# EAGLE design Retro-Lite-Dock-PCB_Pico_Version (EAGLE 9.6.1)

## Sheet 1 of 5: USB-Hub
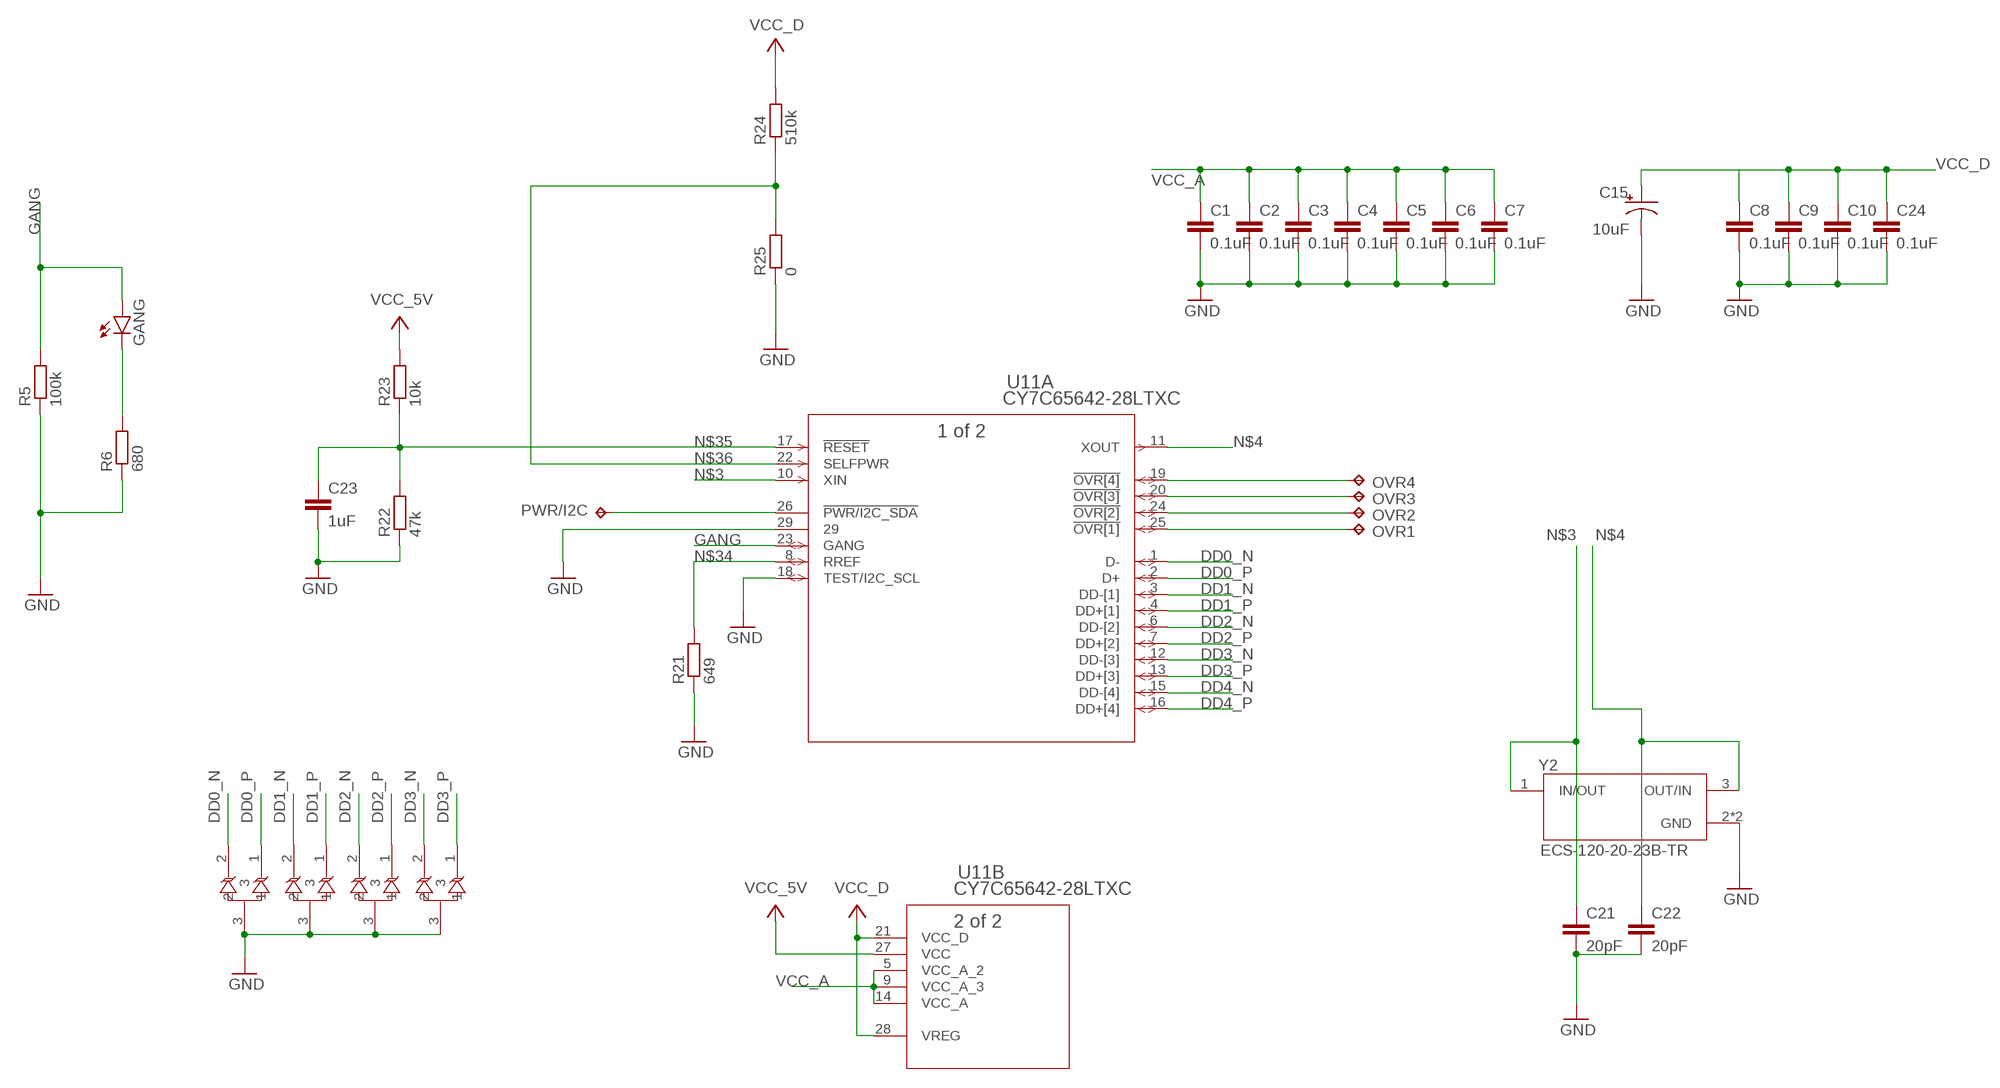
[diagram p0: schematic, sheet 1]

### Parts
C1  0.1uF  C-EUC0603  [C0603]
C2  0.1uF  C-EUC0603  [C0603]
C3  0.1uF  C-EUC0603  [C0603]
C4  0.1uF  C-EUC0603  [C0603]
C5  0.1uF  C-EUC0603  [C0603]
C6  0.1uF  C-EUC0603  [C0603]
C7  0.1uF  C-EUC0603  [C0603]
C8  0.1uF  C-EUC0603  [C0603]
C9  0.1uF  C-EUC0603  [C0603]
C10  0.1uF  C-EUC0603  [C0603]
C15  10uF  PANASONIC-POLAR-SMD  [CAPAE660X610]
C21  20pF  C-EUC0603  [C0603]
C22  20pF  C-EUC0603  [C0603]
C23  1uF  C-EUC0603  [C0603]
C24  0.1uF  C-EUC0603  [C0603]
GANG  LEDSML0603  [SML0603]
OVR1  TPTP09R  [TP09R]
OVR2  TPTP09R  [TP09R]
OVR3  TPTP09R  [TP09R]
OVR4  TPTP09R  [TP09R]
PWR/I2C  TPTP09R  [TP09R]
R5  100k  R-EU_R0603  [R0603]
R6  680  R-EU_R0603  [R0603]
R21  649  R-EU_R0603  [R0603]
R22  47k  R-EU_R0603  [R0603]
R23  10k  R-EU_R0603  [R0603]
R24  510k  R-EU_R0603  [R0603]
R25  0  R-EU_R0603  [R0603]
U2  RCLAMP0582BQTCT  [SC75-3L_SEM]
U3  RCLAMP0582BQTCT  [SC75-3L_SEM]
U4  RCLAMP0582BQTCT  [SC75-3L_SEM]
U10  RCLAMP0582BQTCT  [SC75-3L_SEM]
U11  CY7C65642-28LTXC  [QFN-28]
Y2  ECS-120-20-23B-TR  [XTAL_ECS-120-20-23B-TR]

### Nets
DD0_N [USB2.0]: U10.2 U11.1(A:D-) ; also sheet 4
DD0_P [USB2.0]: U10.1 U11.2(A:D+) ; also sheet 4
DD1_N [USB2.0]: U2.2 U11.3(A:DD-[1]) ; also sheet 5
DD1_P [USB2.0]: U2.1 U11.4(A:DD+[1]) ; also sheet 5
DD2_N [USB2.0]: U3.2 U11.6(A:DD-[2]) ; also sheet 5
DD2_P [USB2.0]: U3.1 U11.7(A:DD+[2]) ; also sheet 5
DD3_N [USB2.0]: U4.2 U11.12(A:DD-[3]) ; also sheet 5
DD3_P [USB2.0]: U4.1 U11.13(A:DD+[3]) ; also sheet 5
DD4_N [USB2.0]: U11.15(A:DD-[4]) ; also sheet 3
DD4_P [USB2.0]: U11.16(A:DD+[4]) ; also sheet 3
GANG: GANG.A R5.2 U11.23(A:GANG)
GND: C1.2 C2.2 C3.2 C4.2 C5.2 C6.2 C7.2 C8.2 C9.2 C10.2 C15.2(-) C21.2 C22.2 C23.2 C24.2 R5.1 R6.1 R21.1 R22.1 R25.1 U2.3 U3.3 U4.3 U10.3 U11.18(A:TEST/I2C_SCL) U11.29 Y2.2(GND) Y2.4(GND) ; also sheet 2,3,4,5
N$1: GANG.C R6.2
N$3: C21.1 U11.10(A:XIN) Y2.1(IN/OUT)
N$4: C22.1 U11.11(A:XOUT) Y2.3(OUT/IN)
N$19: OVR1.TP U11.25(A:!OVR[1])
N$20: OVR2.TP U11.24(A:!OVR[2])
N$21: OVR3.TP U11.20(A:!OVR[3])
N$22: OVR4.TP U11.19(A:!OVR[4])
N$34: R21.2 U11.8(A:RREF)
N$35: C23.1 R22.2 R23.1 U11.17(A:!RESET)
N$36: R24.1 R25.2 U11.22(A:SELFPWR)
PWR/I2C_SDA: PWR/I2C.TP U11.26(A:!PWR/I2C_SDA)
VCC_5V: R23.2 U11.27(B:VCC) ; supply symbol labelled VCC ; also sheet 2,3,4,5
VCC_A: C1.1 C2.1 C3.1 C4.1 C5.1 C6.1 C7.1 U11.5(B:VCC_A_2) U11.9(B:VCC_A_3) U11.14(B:VCC_A) ; also sheet 4
VCC_D: C8.1 C9.1 C10.1 C15.1(+) C24.1 R24.2 U11.21(B:VCC_D) U11.28(B:VREG) ; supply symbol labelled VCC ; also sheet 4

### Notes on the sheet
- 10uF

## Sheet 2 of 5: MAXM17634
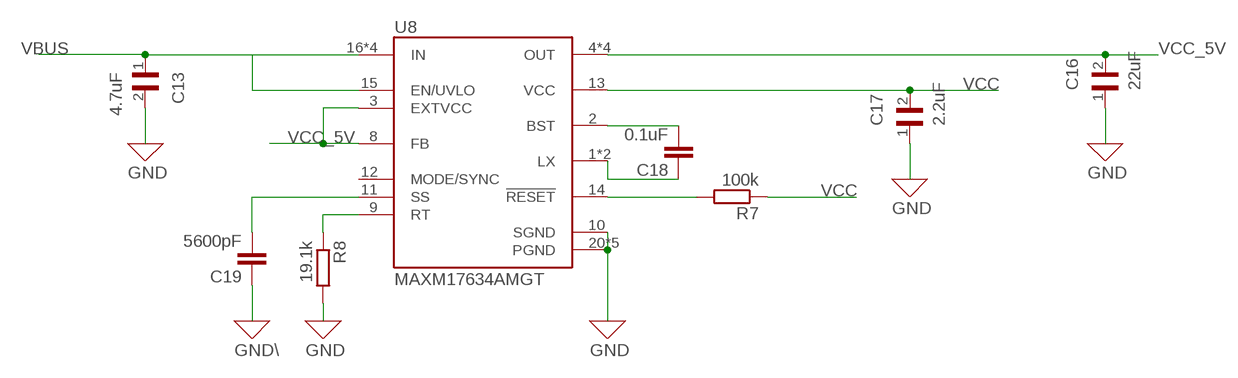
[diagram p1: schematic, sheet 2]

### Parts
C13  4.7uF  GRM31CR71H475KA12K  [CAPC3216X180N]
C16  22uF  GRM32ER71E226KE15K  [CAPC3225X270N]
C17  2.2uF  GRM188R70J225KE15J  [CAPC1608X90N]
C18  0.1uF  C-EUC0603  [C0603]
C19  5600pF  C-EUC0603  [C0603]
R7  100k  R-EU_R0603  [R0603]
R8  19.1k  R-EU_R0603  [R0603]
U8  MAXM17634AMGT  [QFN50P400X400X180-25N]

### Nets
GND: C13.2 C16.1 C17.1 R8.2 U8.10(SGND) U8.20(PGND) U8.21(PGND) U8.22(PGND) U8.23(PGND) U8.25(PGND) ; also sheet 1,3,4,5
GND\: C19.1 ; supply symbol labelled GND
N$8: R7.2 U8.14(!RESET!)
N$11: C18.2 U8.2(BST)
N$12: C18.1 U8.1(LX) U8.24(LX)
N$13: C19.2 U8.11(SS)
N$14: R8.1 U8.9(RT)
VBUS: C13.1 U8.15(EN/UVLO) U8.16(IN) U8.17(IN) U8.18(IN) U8.19(IN) ; also sheet 4
VCC: C17.2 R7.1 U8.13(VCC)
VCC_5V: C16.2 U8.3(EXTVCC) U8.4(OUT) U8.5(OUT) U8.6(OUT) U8.7(OUT) U8.8(FB) ; also sheet 1,3,4,5
Unconnected: U8.12(MODE/SYNC)

## Sheet 3 of 5: RP2040
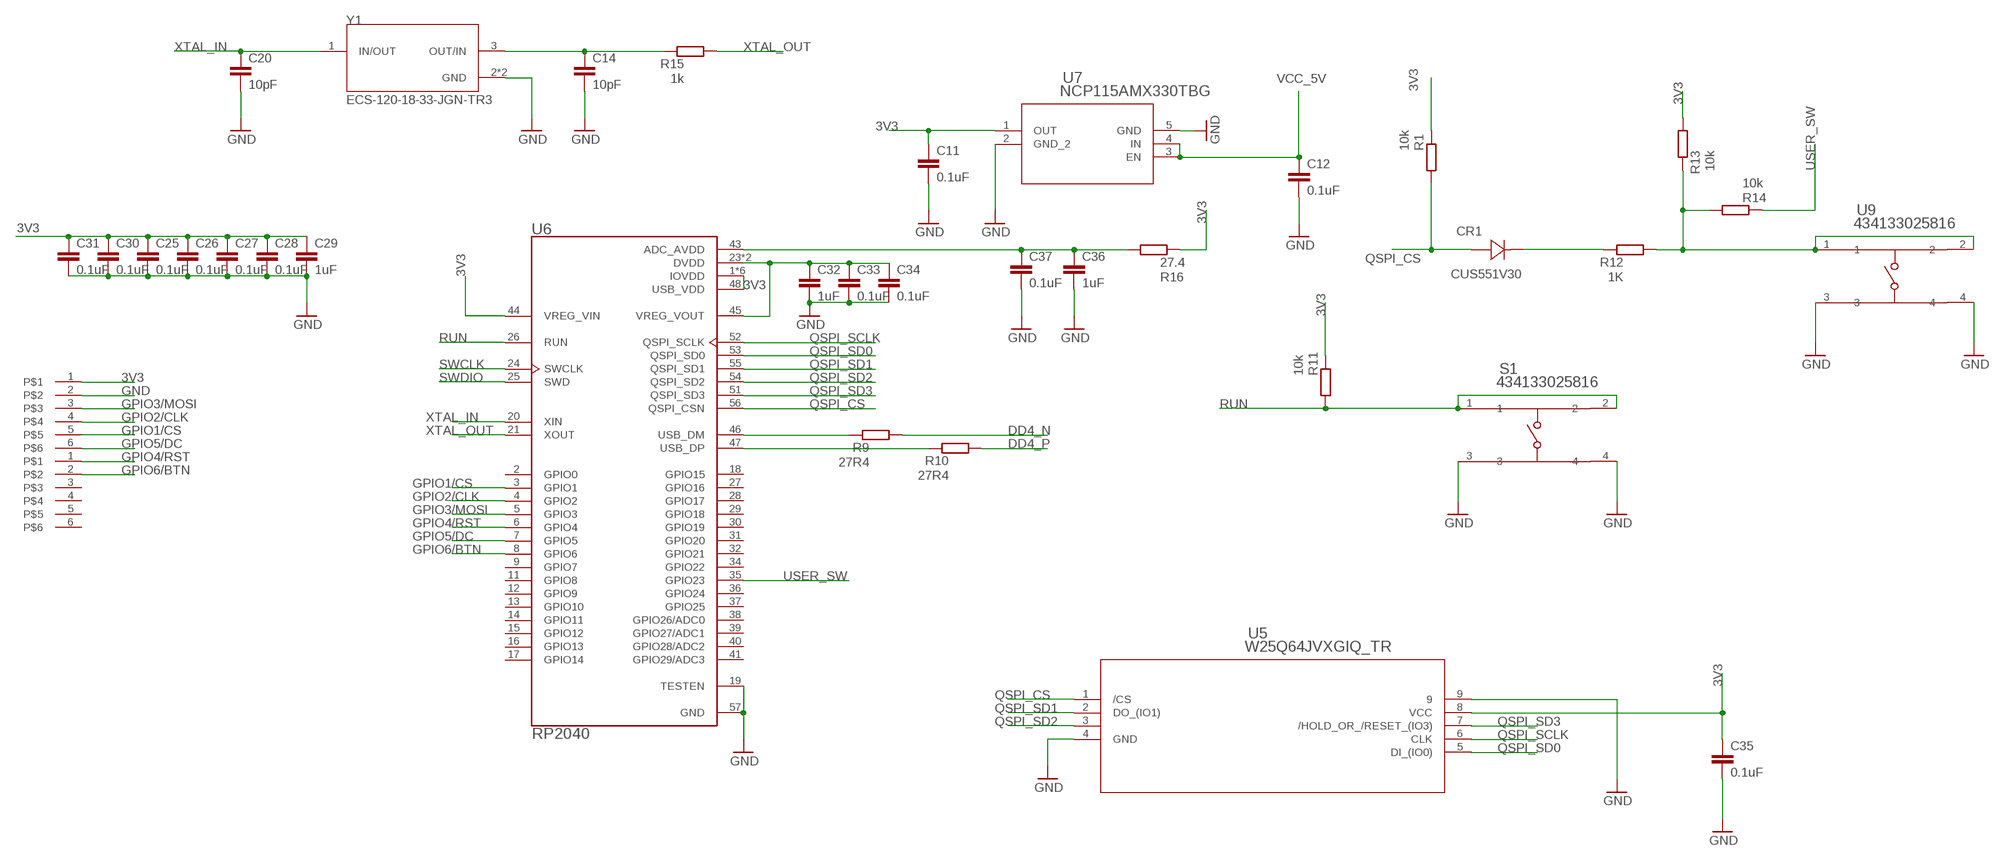
[diagram p2: schematic, sheet 3]

### Parts
C11  0.1uF  C-EUC0603  [C0603]
C12  0.1uF  C-EUC0603  [C0603]
C14  10pF  C-EUC0603  [C0603]
C20  10pF  C-EUC0603  [C0603]
C25  0.1uF  C-EUC0603  [C0603]
C26  0.1uF  C-EUC0603  [C0603]
C27  0.1uF  C-EUC0603  [C0603]
C28  0.1uF  C-EUC0603  [C0603]
C29  1uF  C-EUC0402  [C0402]
C30  0.1uF  C-EUC0402  [C0402]
C31  0.1uF  C-EUC0603  [C0603]
C32  1uF  C-EUC0603  [C0603]
C33  0.1uF  C-EUC0402  [C0402]
C34  0.1uF  C-EUC0603  [C0603]
C35  0.1uF  C-EUC0603  [C0603]
C36  1uF  C-EUC0402  [C0402]
C37  0.1uF  C-EUC0402  [C0402]
CR1  CUS551V30  [USC_TOS]
R1  10k  R-EU_R0603  [R0603]
R9  27R4  R-EU_R0402  [R0402]
R10  27R4  R-EU_R0402  [R0402]
R11  10k  R-EU_R0603  [R0603]
R12  1K  R-EU_R0603  [R0603]
R13  10k  R-EU_R0603  [R0603]
R14  10k  R-EU_R0603  [R0603]
R15  1k  R-EU_R0402  [R0402]
R16  27.4  R-EU_R0402  [R0402]
S1  434133025816  [SMD_025816_WRE]
U5  W25Q64JVXGIQ_TR  [DFN_XGIQ_TR_WIN]
U6  RP2040  [QFN40P700X700X90-57N]
U7  NCP115AMX330TBG  [XDFN4_711AJ_ONS]
U9  434133025816  [SMD_025816_WRE]
U$2  6PINEADER  [1MM_PIC-PROGRAMING_HEADER]
U$3  6PINEADER  [1MM_PIC-PROGRAMING_HEADER]
Y1  ECS-120-18-33-JGN-TR3  [XTAL_ECS-120-18-33-JGN-TR3]

### Nets
3V3: C11.1 C25.1 C26.1 C27.1 C28.1 C29.1 C30.1 C31.1 C35.1 R1.2 R11.2 R13.1 R16.2 U5.8(VCC) U6.1(IOVDD) U6.10(IOVDD) U6.22(IOVDD) U6.33(IOVDD) U6.42(IOVDD) U6.44(VREG_VIN) U6.48(USB_VDD) U6.49(IOVDD) U7.1(OUT) U$3.1
DD4_N [USB2.0]: R9.1 ; also sheet 1
DD4_P [USB2.0]: R10.1 ; also sheet 1
GND: C11.2 C12.2 C14.2 C20.2 C25.2 C26.2 C27.2 C28.2 C29.2 C30.2 C31.2 C32.2 C33.2 C34.2 C35.2 C36.2 C37.2 S1.3 S1.4 U5.4(GND) U5.9 U6.19(TESTEN) U6.57(GND) U7.2(GND_2) U7.5(GND) U9.3 U9.4 U$3.2 Y1.2(GND) Y1.4(GND) ; also sheet 1,2,4,5
GPIO1/CS: U6.3(GPIO1) U$3.5
GPIO2/CLK: U6.4(GPIO2) U$3.4
GPIO3/MOSI: U6.5(GPIO3) U$3.3
GPIO4/RST: U6.6(GPIO4) U$2.1
GPIO5/DC: U6.7(GPIO5) U$3.6
GPIO6/BTN: U6.8(GPIO6) U$2.2
N$5: C32.1 C33.1 C34.1 U6.23(DVDD) U6.45(VREG_VOUT) U6.50(DVDD)
N$5_N: R9.2 U6.46(USB_DM)
N$5_P: R10.2 U6.47(USB_DP)
N$15: R12.1 R13.2 R14.1 U9.1 U9.2
N$16: C14.1 R15.2 Y1.3(OUT/IN)
N$17: C36.1 C37.1 R16.1 U6.43(ADC_AVDD)
N$18: CR1.1(CATHODE) R12.2
QSPI_CS: CR1.2(ANODE) R1.1 U5.1(/CS) U6.56(QSPI_CSN)
QSPI_SCLK: U5.6(CLK) U6.52(QSPI_SCLK)
QSPI_SD0: U5.5(DI_(IO0)) U6.53(QSPI_SD0)
QSPI_SD1: U5.2(DO_(IO1)) U6.55(QSPI_SD1)
QSPI_SD2: U5.3(/WP_(IO2)) U6.54(QSPI_SD2)
QSPI_SD3: U5.7(/HOLD_OR_/RESET_(IO3)) U6.51(QSPI_SD3)
RUN: R11.1 S1.1 S1.2 U6.26(RUN)
SWCLK: U6.24(SWCLK) ; also sheet 4
SWDIO: U6.25(SWD) ; also sheet 4
USER_SW: R14.2 U6.35(GPIO23)
VCC_5V: C12.1 U7.3(EN) U7.4(IN) ; also sheet 1,2,4,5
XTAL_IN: C20.1 U6.20(XIN) Y1.1(IN/OUT)
XTAL_OUT: R15.1 U6.21(XOUT)
Unconnected: U6.2(GPIO0) U6.9(GPIO7) U6.11(GPIO8) U6.12(GPIO9) U6.13(GPIO10) U6.14(GPIO11) U6.15(GPIO12) U6.16(GPIO13) U6.17(GPIO14) U6.18(GPIO15) U6.27(GPIO16) U6.28(GPIO17) U6.29(GPIO18) U6.30(GPIO19) U6.31(GPIO20) U6.32(GPIO21) U6.34(GPIO22) U6.36(GPIO24) U6.37(GPIO25) U6.38(GPIO26/ADC0) U6.39(GPIO27/ADC1) U6.40(GPIO28/ADC2) U6.41(GPIO29/ADC3) U$2.3 U$2.4 U$2.5 U$2.6

## Sheet 4 of 5: FFC Connectors
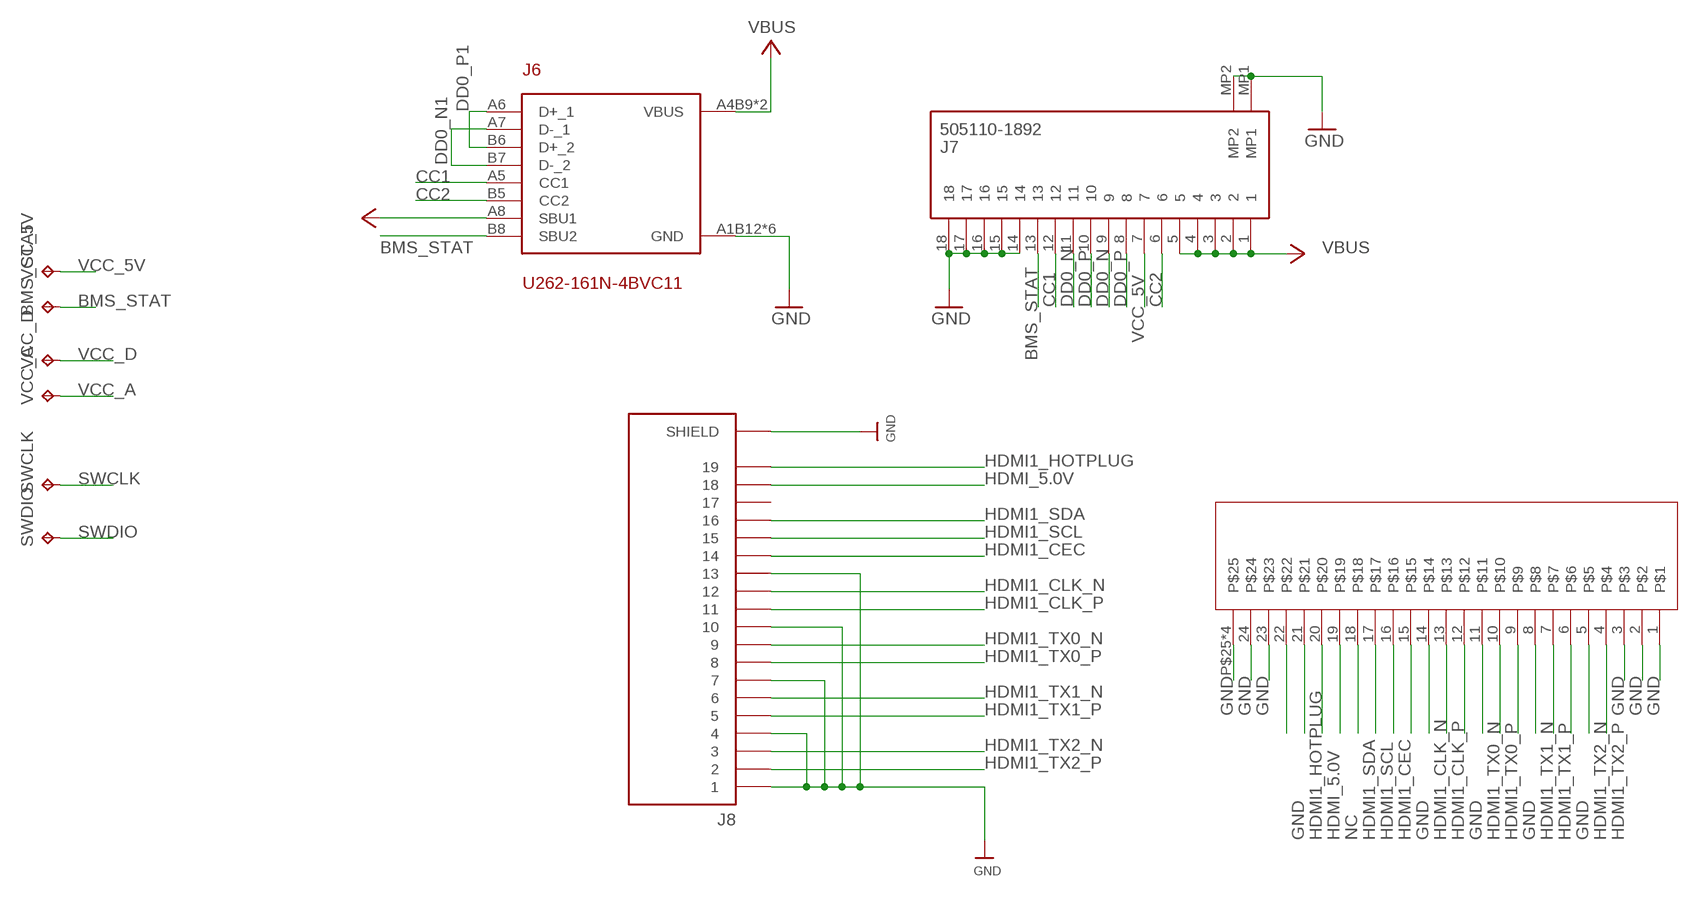
[diagram p3: schematic, sheet 4]

### Parts
BMS_STAT  TPTP09R  [TP09R]
J6  U262-161N-4BVC11  [U262-161N-4BVC11]
J7  505110-1892  [5051101892]
J8  685119136923  [WURTH_685119136923]
SWCLK  TPTP09R  [TP09R]
SWDIO  TPTP09R  [TP09R]
U$1  5022442430_FFC  [5022442430]
VCC_5V  TPTP09R  [TP09R]
VCC_A  TPTP09R  [TP09R]
VCC_D  TPTP09R  [TP09R]

### Nets
BMS_STAT: BMS_STAT.TP J6.B8(SBU2) J7.13
CC1: J6.A5(CC1) J7.12
CC2: J6.B5(CC2) J7.6
DD0_N [USB2.0]: J7.9 J7.11 ; also sheet 1
DD0_N1 [USB2.0]: J6.A7(D-_1) J6.B7(D-_2)
DD0_P [USB2.0]: J7.8 J7.10 ; also sheet 1
DD0_P1 [USB2.0]: J6.A6(D+_1) J6.B6(D+_2)
GND: J6.A1B12(GND) J6.B1A12(GND) J6.SHIELD_1(GND) J6.SHIELD_2(GND) J6.SHIELD_3(GND) J6.SHIELD_4(GND) J7.14 J7.15 J7.16 J7.17 J7.18 J7.MP1 J7.MP2 J8.1 J8.4 J8.7 J8.10 J8.13 J8.S1(SHIELD) J8.S2(SHIELD) J8.S3(SHIELD) J8.S4(SHIELD) U$1.1 U$1.2 U$1.3 U$1.6 U$1.9 U$1.12 U$1.15 U$1.22 U$1.23 U$1.24 U$1.P$25 U$1.P$26 U$1.P$27 U$1.P$28 ; also sheet 1,2,3,5
HDMI1_CEC: J8.14 U$1.16
HDMI1_CLK_N [HDMI]: J8.12 U$1.14
HDMI1_CLK_P [HDMI]: J8.11 U$1.13
HDMI1_HOTPLUG: J8.19 U$1.21
HDMI1_SCL: J8.15 U$1.17
HDMI1_SDA: J8.16 U$1.18
HDMI1_TX0_N [HDMI]: J8.9 U$1.11
HDMI1_TX0_P [HDMI]: J8.8 U$1.10
HDMI1_TX1_N [HDMI]: J8.6 U$1.8
HDMI1_TX1_P [HDMI]: J8.5 U$1.7
HDMI1_TX2_N [HDMI]: J8.3 U$1.5
HDMI1_TX2_P [HDMI]: J8.2 U$1.4
HDMI_5.0V: J8.18 U$1.20
NC: U$1.19
SWCLK: SWCLK.TP ; also sheet 3
SWDIO: SWDIO.TP ; also sheet 3
VBUS: J6.A4B9(VBUS) J6.B4A9(VBUS) J7.1 J7.2 J7.3 J7.4 J7.5 ; supply symbol labelled VCC ; also sheet 2
VCC_5V: J6.A8(SBU1) J7.7 VCC_5V.TP ; supply symbol labelled VCC ; also sheet 1,2,3,5
VCC_A: VCC_A.TP ; also sheet 1
VCC_D: VCC_D.TP ; also sheet 1
Unconnected: J8.17

## Sheet 5 of 5: USB-A Ports
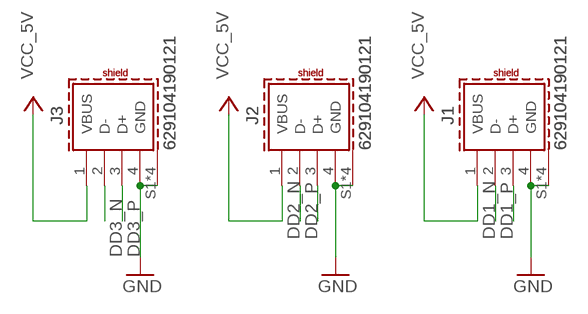
[diagram p4: schematic, sheet 5]

### Parts
J1  629104190121  [629104190121]
J2  629104190121  [629104190121]
J3  629104190121  [629104190121]

### Nets
DD1_N [USB2.0]: J1.2(D-) ; also sheet 1
DD1_P [USB2.0]: J1.3(D+) ; also sheet 1
DD2_N [USB2.0]: J2.2(D-) ; also sheet 1
DD2_P [USB2.0]: J2.3(D+) ; also sheet 1
DD3_N [USB2.0]: J3.2(D-) ; also sheet 1
DD3_P [USB2.0]: J3.3(D+) ; also sheet 1
GND: J1.4(GND) J1.S1(SHIELD) J1.S2(SHIELD) J1.S3(SHIELD) J1.S4(SHIELD) J2.4(GND) J2.S1(SHIELD) J2.S2(SHIELD) J2.S3(SHIELD) J2.S4(SHIELD) J3.4(GND) J3.S1(SHIELD) J3.S2(SHIELD) J3.S3(SHIELD) J3.S4(SHIELD) ; also sheet 1,2,3,4
VCC_5V: J1.1(VBUS) J2.1(VBUS) J3.1(VBUS) ; supply symbol labelled VCC ; also sheet 1,2,3,4

## Library data of the parts
BMS_STAT OVR1-OVR4 PWR/I2C SWCLK SWDIO VCC_5V VCC_A VCC_D = testpad:TP: Test pad
C1-C12 C14 C18-C37 = rcl:C-EU: CAPACITOR, European symbol; SPICEPREFIX: C
C13 = GRM31CR71H475KA12K:GRM31CR71H475KA12K: Capacitor Ceramic multilayer; DESCRIPTION: SMD Capacitor X7R(EIA) with Capacitance: 4.7uF Tol. 10%. Rated Voltage: 50Vdc; DIGI-KEY_PART_NUMBER: 490-GRM31CR71H475KA12KTR-ND; MF: Murata; MP: GRM31CR71H475KA12K; PACKAGE: 3216 Murata; PURCHASE-URL: https://pricing.snapeda.com/search/part/GRM31CR71H475KA12K/?ref=eda
C15 = LCD_Driver:PANASONIC-POLAR-SMD
C16 = GRM32ER71E226KE15K:GRM32ER71E226KE15K: SMD Capacitor X7R(EIA) with Capacitance: 22uF Tol. 10%. Rated Voltage: 25Vdc Check availability <https://pricing.snapeda.com/parts/GRM32ER71E226KE15K/Murata/view-part?ref=eda>; AVAILABILITY: In Stock; DESCRIPTION: SMD capacitor X7R(EIA) with capacitance 22uF Tol.10%. Rated voltage 25Vdc 125C; MF: Murata; MP: GRM32ER71E226KE15K; PACKAGE: 3225 Murata; PRICE: None; PURCHASE-URL: https://pricing.snapeda.com/search/part/GRM32ER71E226KE15K/?ref=eda
C17 = GRM188R70J225KE15J:GRM188R70J225KE15J: SMD Capacitor X7R(EIA) with Capacitance: 2.2uF Tol. 10%. Rated Voltage: 6.3Vdc Check availability <https://pricing.snapeda.com/parts/GRM188R70J225KE15J/Murata/view-part?ref=eda>; AVAILABILITY: In Stock; DESCRIPTION: SMD capacitor X7R(EIA) with capacitance 2.2uF Tol.10%. Rated voltage 6.3Vdc 125C; MF: Murata; MP: GRM188R70J225KE15J; PACKAGE: 1608 Murata; PRICE: None; PURCHASE-URL: https://pricing.snapeda.com/search/part/GRM188R70J225KE15J/?ref=eda
CR1 = CUS551V30H3FCT-ND:CUS551V30; COPYRIGHT: Copyright (C) 2022 Ultra Librarian. All rights reserved.; DIGI-KEY_PART_NUMBER_1: CUS551V30H3FCT-ND; DIGI-KEY_PART_NUMBER_2: CUS551V30H3FDKR-ND; DIGI-KEY_PART_NUMBER_3: CUS551V30H3FTR-ND; MANUFACTURER_PART_NUMBER: CUS551V30; MFR_NAME: Toshiba Electronic Devices & Storage Corp.
GANG = led:LED: LED OSRAM: - CHIPLED LG R971, LG N971, LY N971, LG Q971, LY Q971, LO R971, LY R971 LH N974, LH R974 LS Q976, LO Q976, LY Q976 LO Q996 - Hyper CHIPLED LW Q18S LB Q993, LB Q99A, LB R99A - SideLED LS A670, LO A670, LY A670, LG A670, LP A670 LB A673, LV A673, LT A673, LW A673 LH A674 LY A675 LS A676, LA A676, LO A676, LY A676, LW A676 LS A679, LY A679, LG A679 - Hyper Micro SIDELED® LS Y876, LA Y876, LO Y876, LY Y876 LT Y87S - SmartLED LW L88C, LW L88S LB L89C, LB L89S, LG L890 LS L89K, LO L89K, LY L89K LS L896, LA L896, LO L896, LY L896 - TOPLED LS T670, LO T670, LY T670, LG T670, LP T670 LSG T670, LSP T670, LSY T670, LOP T670, LYG T670 LG T671, LOG T671, LSG T671 LB T673, LV T673, LT T673, LW T673 LH T674 LS T676, LA T676, LO T676, LY T676, LB T676, LH T676, LSB T676, LW T676 LB T67C, LV T67C, LT T67C, LS T67K, LO T67K, LY T67K, LW E67C LS E67B, LA E67B, LO E67B, LY E67B, LB E67C, LV E67C, LT E67C LW T67C LS T679, LY T679, LG T679 LS T770, LO T770, LY T770, LG T770, LP T770 LB T773, LV T773, LT T773, LW T773 LH T774 LS E675, LA E675, LY E675, LS T675 LS T776, LA T776, LO T776, LY T776, LB T776 LHGB T686 LT T68C, LB T68C - Hyper Mini TOPLED® LB M676 - Mini TOPLED Santana® LG M470 LS M47K, LO M47K, LY M47K Source: http://www.osram.convergy.de LUXEON: - LUMILED® LXK2-PW12-R00, LXK2-PW12-S00, LXK2-PW14-U00, LXK2-PW14-V00 LXK2-PM12-R00, LXK2-PM12-S00, LXK2-PM14-U00 LXK2-PE12-Q00, LXK2-PE12-R00, LXK2-PE12-S00, LXK2-PE14-T00, LXK2-PE14-U00 LXK2-PB12-K00, LXK2-PB12-L00, LXK2-PB12-M00, LXK2-PB14-N00, LXK2-PB14-P00, LXK2-PB14-Q00 LXK2-PR12-L00, LXK2-PR12-M00, LXK2-PR14-Q00, LXK2-PR14-R00 LXK2-PD12-Q00, LXK2-PD12-R00, LXK2-PD12-S00 LXK2-PH12-R00, LXK2-PH12-S00 LXK2-PL12-P00, LXK2-PL12-Q00, LXK2-PL12-R00 Source: www.luxeon.com KINGBRIGHT: KA-3528ASYC Source: www.kingbright.com
J1-J3 = 629104190121:629104190121: WR-COM USB 2.0 Type A Horizontal SMT Short Type Kind Properties Durability:1500 Mating cycles Quality Class:1500 Mating cycles Connector Type:USB 2.0 Gender:Receptacle Type:Horizontal - Short Type General Information Operating Temperature:-40 up to +85 °C Compliance:RoHS Electrical Properties IR 1:1.5A Working Voltage:30V (AC) Withstanding Voltage:500 V (AC) Contact Resistance:30 mΩ Material Properties Insulator Material:LCP Insulator Flammability Rating:UL94 V-0 Color:Black Cover Material:Brass Cover Plating:Nickel Contact Material:Brass Contact Plating:Gold over Nickel Contact Type:Stamped Shielding Material:Brass Shielding Plating:Nickel <https://www.we-online.com/catalog/media/o85075v209%20Family_WR-COM_629104190121.jpg> Details see: https://www.we-online.com/catalog/en/COM_2_0_SMT_TYPE_A_HORIZONTAL_SHORT_TYPE/ Updated by Yingchun, Shan 2020-01-15 2020 (C) Würth Elektronik Check prices <https://pricing.snapeda.com/parts/629104190121/W%C3%BCrth%20Elektronik/view-part?ref=eda>; AVAILABILITY: In Stock; DESCRIPTION: USB-A (USB TYPE-A) USB 2.0 Receptacle Connector 4 Position Surface Mount, Right Angle; MF: Würth Elektronik; MP: 629104190121; PACKAGE: None; PRICE: None
J6 = gustl_U262-161N-4BVC11:U262-161N-4BVC11
J7 = 505110-1892:505110-1892: Molex Easy-On Series 0.5mm Pitch 18 Way Right Angle SMT Male FPC Connector, ZIF Bottom Contact Source: Datasheet <https://componentsearchengine.com/Datasheets/2/505110-1892.pdf>; DESCRIPTION: Molex Easy-On Series 0.5mm Pitch 18 Way Right Angle SMT Male FPC Connector, ZIF Bottom Contact; HEIGHT: 2.1mm; MANUFACTURER_NAME: Molex; MANUFACTURER_PART_NUMBER: 505110-1892; MOUSER_PART_NUMBER: 538-505110-1892; MOUSER_PRICE-STOCK: https://www.mouser.com/Search/Refine.aspx?Keyword=538-505110-1892
J8 = 685119136923:685119136923: HDMI - Mini Receptacle Connector 19 Position Surface Mount, Right Angle; Through Hole Check availability <https://pricing.snapeda.com/parts/685119136923/Wurth%20Electronics/view-part?ref=eda>; AVAILABILITY: In Stock; DESCRIPTION: HDMI - Mini - Receptacle Connector 19 Position Surface Mount, Right Angle; Through Hole; MF: Wurth Electronics; MP: 685119136923; PACKAGE: None; PRICE: None; PURCHASE-URL: https://pricing.snapeda.com/search/part/685119136923/?ref=eda
R1 R5-R16 R21-R25 = rcl:R-EU_: RESISTOR, European symbol; SPICEPREFIX: R
S1 U9 = TACT:434133025816; COPYRIGHT: Copyright (C) 2022 Ultra Librarian. All rights reserved.; DIGI-KEY_PART_NUMBER_1: 732-13663-2-ND; DIGI-KEY_PART_NUMBER_2: 732-13663-1-ND; DIGI-KEY_PART_NUMBER_3: 732-13663-6-ND; MANUFACTURER_PART_NUMBER: 434133025816; MFR_NAME: Wurth Electronics
U2-U4 U10 = Semtech RClamp0582B:RCLAMP0582BQTCT; BUILT_BY: EMA_Justin; COPYRIGHT: Copyright (C) 2018 Accelerated Designs. All rights reserved; MANUFACTURER_PART_NUMBER: RCLAMP0582BQTCT; SOURCELIBRARY: Semtech_2019-11-26; VENDOR: Semtech Corporation
U5 = W25Q64JVXGIQ:W25Q64JVXGIQ_TR; COPYRIGHT: Copyright (C) 2022 Ultra Librarian. All rights reserved.; DIGI-KEY_PART_NUMBER_1: 256-W25Q64JVXGIQTR-ND; MANUFACTURER_PART_NUMBER: W25Q64JVXGIQ TR; MFR_NAME: Winbond
U6 = RP2040:RP2040: Check availability <https://pricing.snapeda.com/parts/RP2040/Raspberry%20Pi/view-part?ref=eda>; AVAILABILITY: In Stock; DESCRIPTION: RP2040 chip for Raspberry Pi Pico - ARM® Cortex®-M0+ MCU 32-Bit; MF: Raspberry Pi; MP: RP2040; PACKAGE: None; PRICE: None; PURCHASE-URL: https://pricing.snapeda.com/search/part/RP2040/?ref=eda
U7 = NCP115AMX330TBG:NCP115AMX330TBG; COPYRIGHT: Copyright (C) 2022 Ultra Librarian. All rights reserved.; DIGI-KEY_PART_NUMBER_1: NCP115AMX330TBG-ND; MANUFACTURER_PART_NUMBER: NCP115AMX330TBG; MFR_NAME: onsemi
U8 = MAXM17634AMGT:MAXM17634AMGT: High-Efficiency Synchronous Buck Regulator Offers Balance of High Performance, Wide Temperature Range, and Small Size Check availability <https://pricing.snapeda.com/parts/MAXM17634AMG/Analog%20Devices%20Inc./Maxim%20Integrated/view-part?ref=eda>; AVAILABILITY: In Stock; DESCRIPTION: DC DC CONVERTER 5V 2A; MF: Analog Devices Inc./Maxim Integrated; MP: MAXM17634AMG; PACKAGE: None; PRICE: None; PURCHASE-URL: https://pricing.snapeda.com/search/part/MAXM17634AMG/?ref=eda
U11 = CY7C65642-28LTXCQFN-28:CY7C65642-28LTXC; COPYRIGHT: Copyright (C) 2022 Ultra Librarian. All rights reserved.; DIGI-KEY_PART_NUMBER_1: 428-3149-ND; DIGI-KEY_PART_NUMBER_2: 2156-CY7C65642-28LTXC-ND; MANUFACTURER_PART_NUMBER: CY7C65642-28LTXC; MFR_NAME: Cypress Semiconductor
U$1 = 5022442430:5022442430_FFC
U$2 U$3 = ayys:6PINEADER
Y1 = ECS-120-18-33-JGN-TR3:ECS-120-18-33-JGN-TR3: The sub miniature ECX-32 is a compact SMD Crystal. The 3.2 x 2.5 x 0.8 mm ceramic package is ideal for today’s SMD manufacturing environment.; MF: ECS Inc.; MP: ECS-120-18-33-JGN-TR3; PACKAGE: None; PURCHASE-URL: https://pricing.snapeda.com/search/part/ECS-120-18-33-JGN-TR3/?ref=eda
Y2 = ECS-120-20-23B-TR:ECS-120-20-23B-TR: Miniature SMD crystal 4-pad; DESCRIPTION: 12 MHz ±30ppm Crystal 20pF 50 Ohms 4-SMD, No Lead; DIGI-KEY_PART_NUMBER: XC1013TR-ND; MF: ECS Inc.; MP: ECS-120-20-23B-TR; PACKAGE: SMD-4 ECS International; PURCHASE-URL: https://pricing.snapeda.com/search/part/ECS-120-20-23B-TR/?ref=eda

## Net classes
1 USB2.0: width 0.192 mm, clearance 0.114 mm
2 HDMI: width 0.126 mm, clearance 0.102 mm

## Board
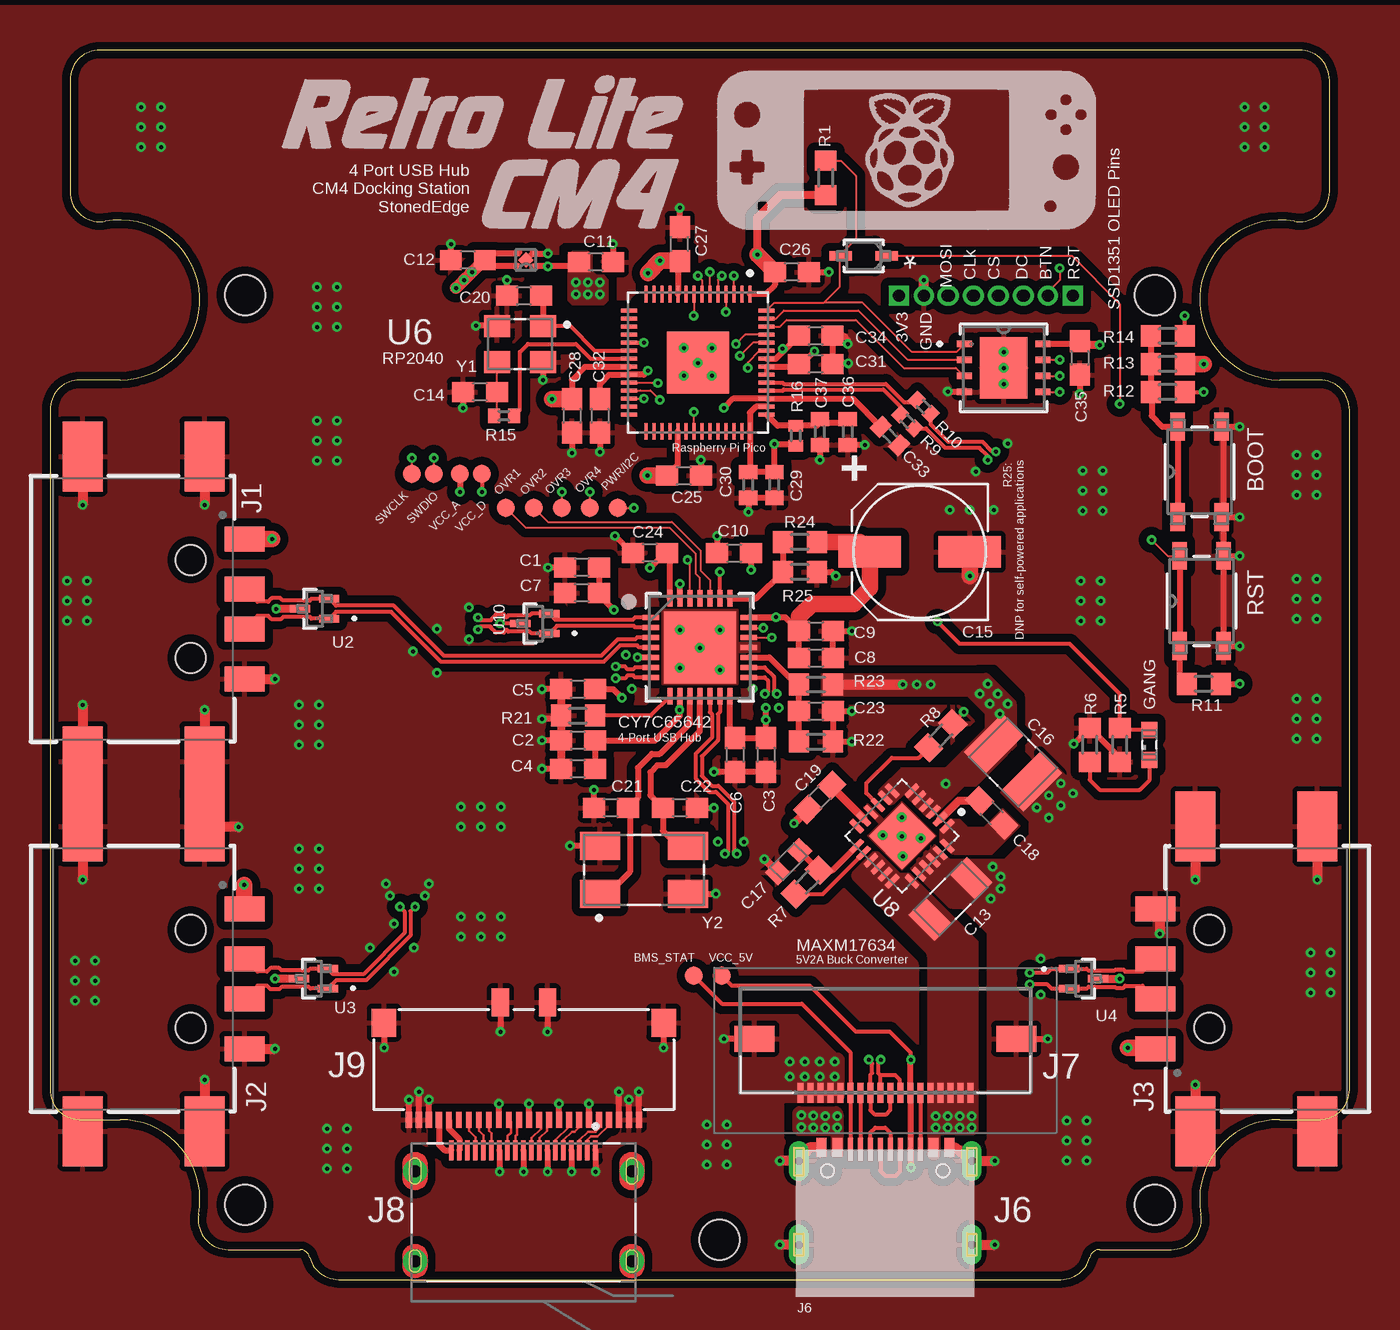
[diagram p5: board, top side]
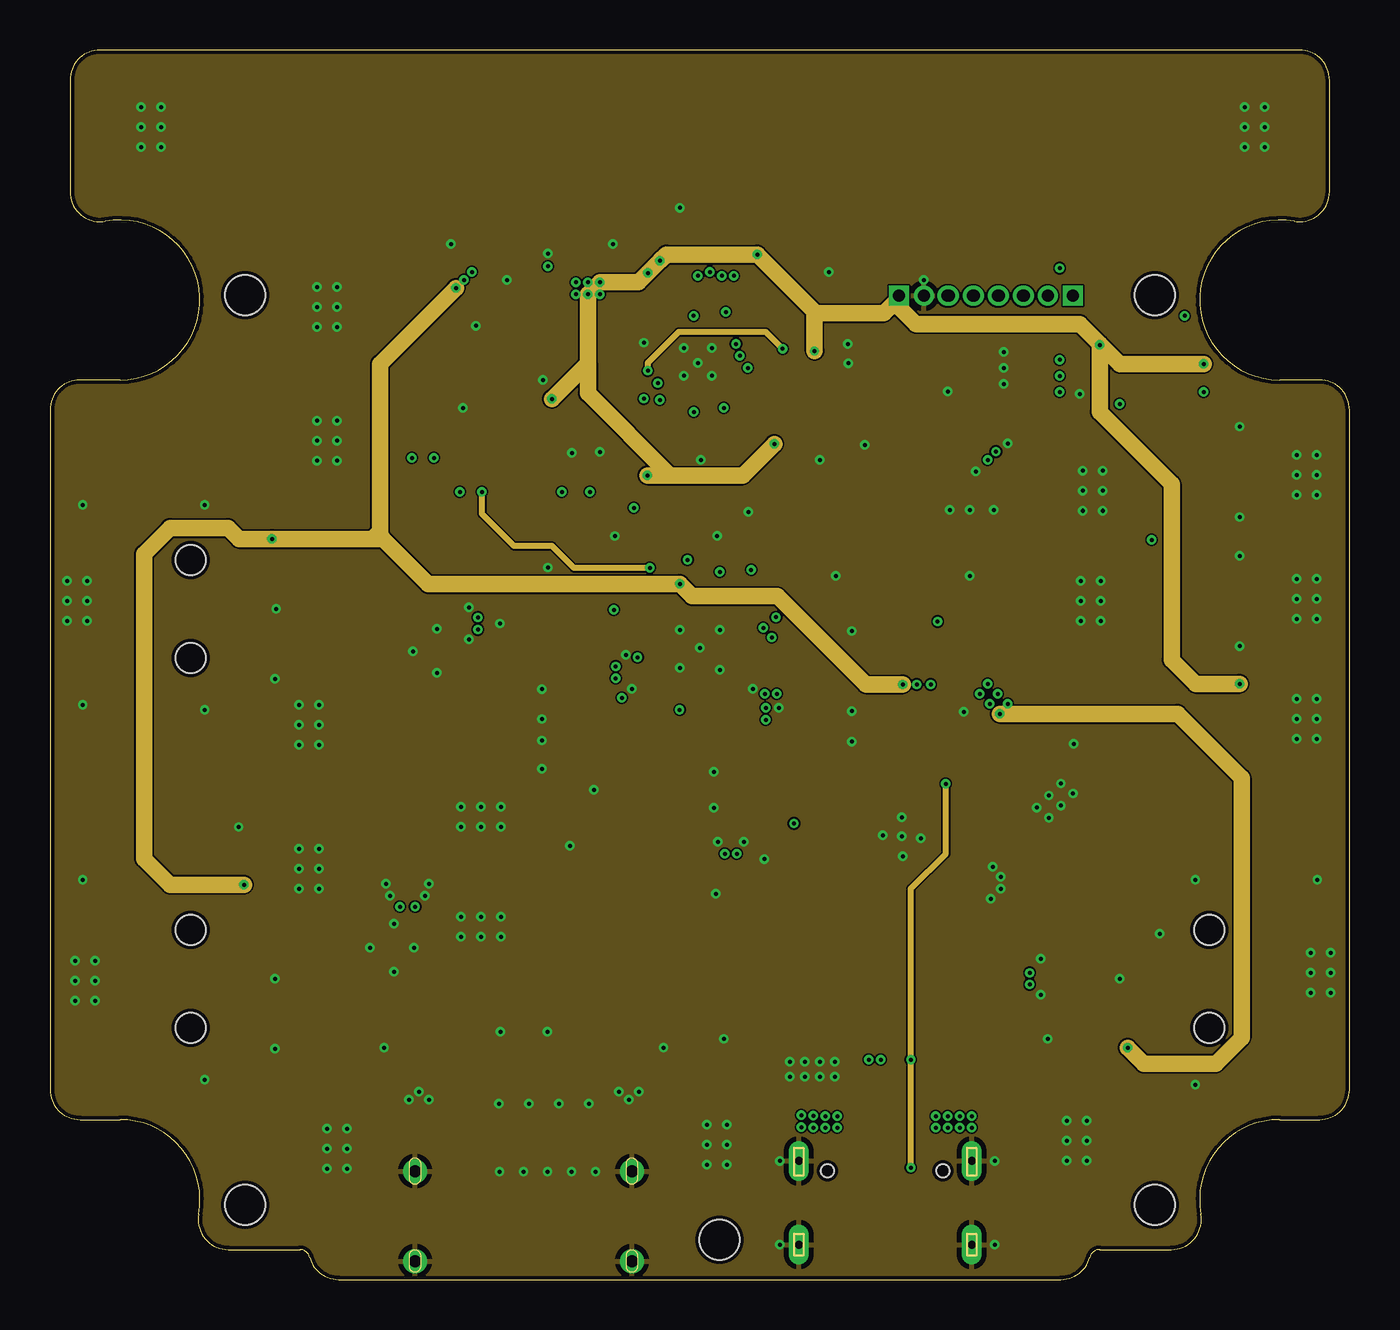
[diagram p6: board, inner layer Route2]
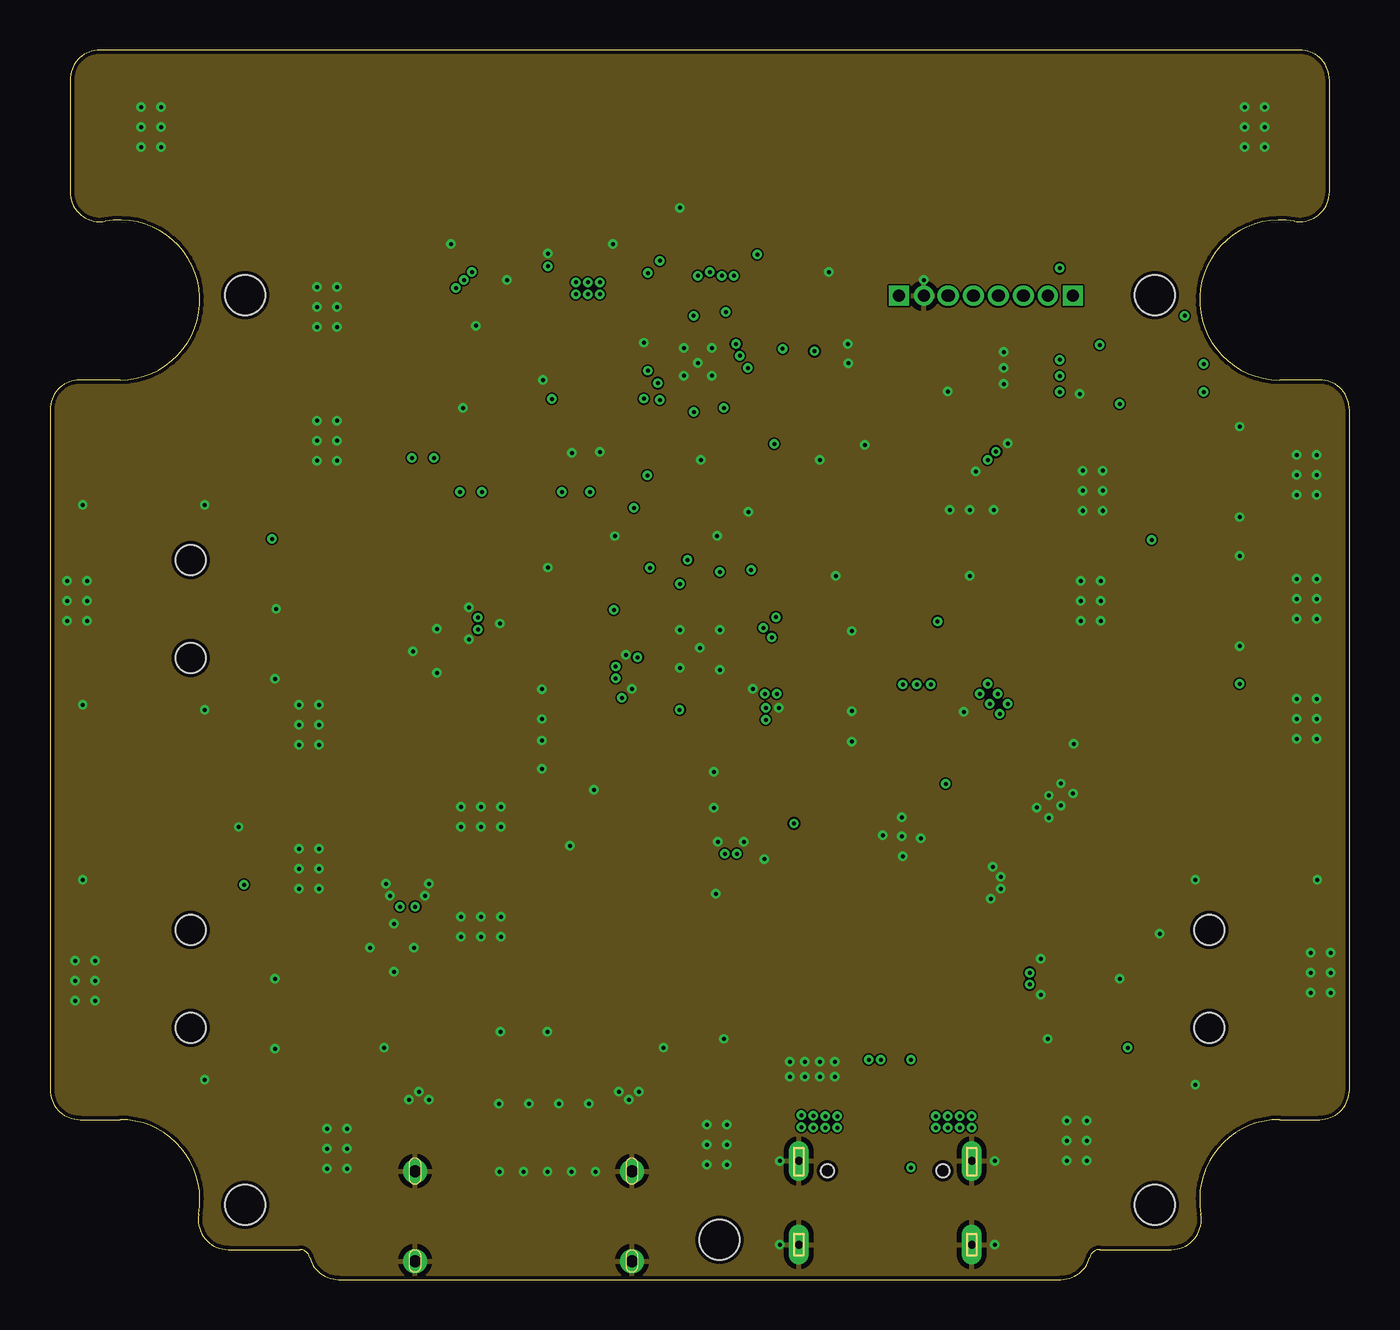
[diagram p7: board, inner layer Route15]
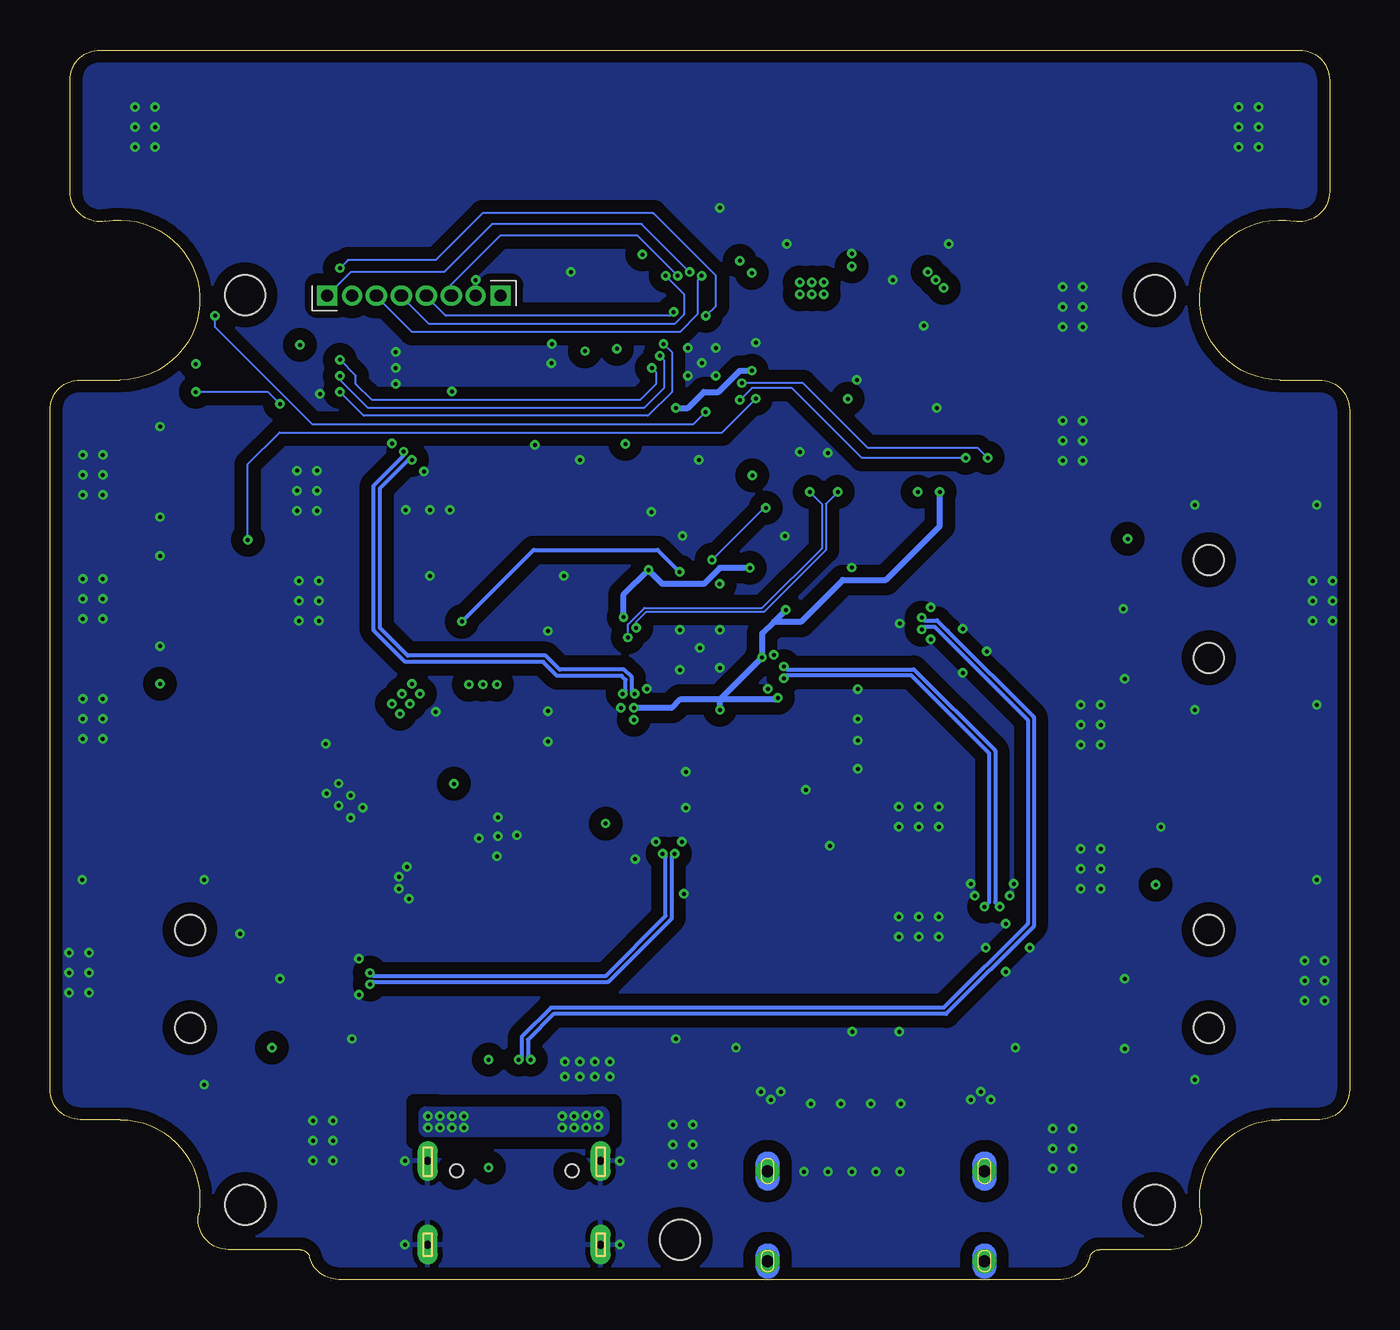
[diagram p8: board, bottom side, seen from below]

Size 65 x 61.5 mm. Coordinates in mm from the lower left corner, seen from the top.
Outline: 12.98,1.12 arc76 12.5,1.5 8.91,1.5 arc-100 7.43,3.27 arc100 3.5,8 1.5,8 arc-90 0,9.5 0,43.5 arc-90 1.5,45 3.5,45 arc190 2.77,52.93 arc-100 1,54.41 1,60 arc-90 2.5,61.5 62.5,61.5 arc-90 64,60 64,54.41 arc-100 62.23,52.93 arc190 61.5,45 63.5,45 arc-90 65,43.5 65,9.5 arc-90 63.5,8 61.5,8 arc100 57.57,3.27 arc-100 56.09,1.5 52.5,1.5 arc76 52.02,1.12 arc-76 50.56,0 14.44,0 arc-76 12.98,1.12
Copper layers (1+2*15+16): Top 0.035mm / dielectric 0.2mm / Route2 0.0175mm / dielectric 1.065mm / Route15 0.0175mm / dielectric 0.2mm / Bottom 0.035mm
Design rules "default *": minimum track width 3.5mil, minimum drill 0.2mm, track to track 3.5mil, track to pad 5mil, pad to pad 5mil, via to via 5mil, smd to smd 0mil, copper to edge 0.2mm, drill to drill 5mil, minimum pad ring 0.1mm, minimum via ring 0.13mm, stop-mask expansion 0mil, vias tented up to drill 100mil, thermal gap 10mil
Holes 2 mm at 55.25,3.75 9.75,3.75 55.25,49.25 9.75,49.25 33.48,2
tRestrict: area 29.5,43 to 35.3,48.8; 4 lines

### Footprints (pad centres in the part's own frame; a part is rotated, then mirrored left to right if it is on the bottom)
TP09R = smd 0.9 x 0.9: TP 0,0
C0603 = smd 1.1 x 1: 1 -0.85,0; 2 0.85,0
CAPC3216X180N = smd 1.21 x 1.82: 1 -1.45,0; 2 1.45,0
CAPAE660X610 = smd 3.112 x 1.579: 1 -2.5,0; 2 2.5,0
CAPC3225X270N = smd 1.53 x 2.72: 1 -1.341,0; 2 1.341,0
CAPC1608X90N = smd 0.89 x 0.93: 1 -0.77,0; 2 0.77,0
C0402 = smd 0.7 x 0.9: 1 -0.65,0; 2 0.65,0
USC_TOS = smd 1.111 x 0.451: 1 -1.15,0; 2 1.15,0
SML0603 = smd 0.8 x 0.8: A 0.75,0; C -0.75,0
629104190121 = smd 1.25 x 2: 1 -3.5,5.6; 2 -1,5.6; 3 1,5.6; 4 3.5,5.6 | smd 3.5 x 2: S1 -7.625,3.6; S2 7.625,3.6; S3 -7.625,-2.5; S4 7.625,-2.5 | hole 1.5: -2.45,2.9; 2.45,2.9
U262-161N-4BVC11 = smd 0.5 x 0.95: A1B12 -3.2,7.455; A4B9 -2.4,7.455; B1A12 3.2,7.455; B4A9 2.4,7.455 | smd 0.25 x 1.15: A5 -1.25,7.355; A6 -0.25,7.355; A7 0.25,7.355; A8 1.25,7.355; B5 1.75,7.355; B6 0.75,7.355; B7 -0.75,7.355; B8 -1.75,7.355 | drill 0.4 pad 1 long: SHIELD_1 -4.325,6.78; SHIELD_2 -4.325,2.6; SHIELD_3 4.325,6.78; SHIELD_4 4.325,2.6 | hole 0.65: -2.89,6.28; 2.89,6.28
5051101892 = smd 0.3 x 1: 1 -4.25,2.625; 2 -3.75,2.625; 3 -3.25,2.625; 4 -2.75,2.625; 5 -2.25,2.625; 6 -1.75,2.625; 7 -1.25,2.625; 8 -0.75,2.625; 9 -0.25,2.625; 10 0.25,2.625; 11 0.75,2.625; 12 1.25,2.625; 13 1.75,2.625; 14 2.25,2.625; 15 2.75,2.625; 16 3.25,2.625; 17 3.75,2.625; 18 4.25,2.625 | smd 2 x 1.3: MP1 -6.55,-0.075; MP2 6.55,-0.075
WURTH_685119136923 = smd 0.23 x 1: 1 3.6,0; 2 3.2,0; 3 2.8,0; 4 2.4,0; 5 2,0; 6 1.6,0; 7 1.2,0; 8 0.8,0; 9 0.4,0; 10 0,0; 11 -0.4,0; 12 -0.8,0; 13 -1.2,0; 14 -1.6,0; 15 -2,0; 16 -2.4,0; 17 -2.8,0; 18 -3.2,0; 19 -3.6,0 | drill 0.6 pad 1.2: S1 -5.425,-1.05; S2 -5.425,-5.55; S3 5.425,-5.55; S4 5.425,-1.05
R0603 = smd 1 x 1.1: 1 -0.85,0; 2 0.85,0
R0402 = smd 0.6 x 0.7: 1 -0.5,0; 2 0.5,0
SMD_025816_WRE = smd 1.397 x 0.711: 1 -2.261,1.1; 2 2.261,1.1; 3 -2.261,-1.1; 4 2.261,-1.1
SC75-3L_SEM = smd 0.365 x 1.005: 1 -0.495,-0.724; 2 0.495,-0.724; 3 0,0.724
DFN_XGIQ_TR_WIN = smd 0.762 x 0.305: 1 -1.968,1.2; 2 -1.968,0.4; 3 -1.968,-0.4; 4 -1.968,-1.2; 5 1.968,-1.2; 6 1.968,-0.4; 7 1.968,0.4; 8 1.968,1.2 | smd 2.388 x 3.099: 9 0,0
QFN40P700X700X90-57N = smd 0.84 x 0.2: 1 -3.435,2.6; 2 -3.435,2.2; 3 -3.435,1.8; 4 -3.435,1.4; 5 -3.435,1; 6 -3.435,0.6; 7 -3.435,0.2; 8 -3.435,-0.2; 9 -3.435,-0.6; 10 -3.435,-1; 11 -3.435,-1.4; 12 -3.435,-1.8; 13 -3.435,-2.2; 14 -3.435,-2.6; 29 3.435,-2.6; 30 3.435,-2.2; 31 3.435,-1.8; 32 3.435,-1.4; 33 3.435,-1; 34 3.435,-0.6; 35 3.435,-0.2; 36 3.435,0.2; 37 3.435,0.6; 38 3.435,1; 39 3.435,1.4; 40 3.435,1.8; 41 3.435,2.2; 42 3.435,2.6 | smd 0.2 x 0.84: 15 -2.6,-3.435; 16 -2.2,-3.435; 17 -1.8,-3.435; 18 -1.4,-3.435; 19 -1,-3.435; 20 -0.6,-3.435; 21 -0.2,-3.435; 22 0.2,-3.435; 23 0.6,-3.435; 24 1,-3.435; 25 1.4,-3.435; 26 1.8,-3.435; 27 2.2,-3.435; 28 2.6,-3.435; 43 2.6,3.435; 44 2.2,3.435; 45 1.8,3.435; 46 1.4,3.435; 47 1,3.435; 48 0.6,3.435; 49 0.2,3.435; 50 -0.2,3.435; 51 -0.6,3.435; 52 -1,3.435; 53 -1.4,3.435; 54 -1.8,3.435; 55 -2.2,3.435; 56 -2.6,3.435 | smd 3.1 x 3.1: 57 0,0
XDFN4_711AJ_ONS = smd 0.229 x 0.254: 1 -0.483,0.324; 2 -0.483,-0.324; 3 0.483,-0.324; 4 0.483,0.324 | smd 0.533 x 0.533 rotated 45: 5 0,0
QFN50P400X400X180-25N = smd 0.81 x 0.27: 1 -1.95,1.25; 2 -1.95,0.75; 3 -1.95,0.25; 4 -1.95,-0.25; 5 -1.95,-0.75; 6 -1.95,-1.25; 13 1.95,-1.25; 14 1.95,-0.75; 15 1.95,-0.25; 16 1.95,0.25; 17 1.95,0.75; 18 1.95,1.25 | smd 0.27 x 0.81: 7 -1.25,-1.95; 8 -0.75,-1.95; 9 -0.25,-1.95; 10 0.25,-1.95; 11 0.75,-1.95; 12 1.25,-1.95; 19 1.25,1.95; 20 0.75,1.95; 21 0.25,1.95; 22 -0.25,1.95; 23 -0.75,1.95; 24 -1.25,1.95 | smd 2.35 x 2.35: 25 0,0
QFN-28 = smd 0.813 x 0.254: 1 -2.451,1.5; 2 -2.451,1; 3 -2.451,0.5; 4 -2.451,0; 5 -2.451,-0.5; 6 -2.451,-1; 7 -2.451,-1.5; 15 2.451,-1.5; 16 2.451,-1; 17 2.451,-0.5; 18 2.451,0; 19 2.451,0.5; 20 2.451,1; 21 2.451,1.5 | smd 0.254 x 0.813: 8 -1.5,-2.451; 9 -1,-2.451; 10 -0.5,-2.451; 11 0,-2.451; 12 0.5,-2.451; 13 1,-2.451; 14 1.5,-2.451; 22 1.5,2.451; 23 1,2.451; 24 0.5,2.451; 25 0,2.451; 26 -0.5,2.451; 27 -1,2.451; 28 -1.5,2.451 | smd 3.607 x 3.607: 29 0,0
5022442430 = smd 0.3 x 0.8: 1 -5.75,0; 2 -5.25,0; 3 -4.75,0; 4 -4.25,0; 5 -3.75,0; 6 -3.25,0; 7 -2.75,0; 8 -2.25,0; 9 -1.75,0; 10 -1.25,0; 11 -0.75,0; 12 -0.25,0; 13 0.25,0; 14 0.75,0; 15 1.25,0; 16 1.75,0; 17 2.25,0; 18 2.75,0; 19 3.25,0; 20 3.75,0; 21 4.25,0; 22 4.75,0; 23 5.25,0; 24 5.75,0 | smd 1.22 x 1.4: P$25 -6.99,-4.85; P$26 6.99,-4.85 | smd 0.85 x 1.4: P$27 -1.175,-5.86; P$28 1.175,-5.86
1MM_PIC-PROGRAMING_HEADER = drill 0.6 pad 1 square: 1 -1.25,1 | drill 0.6 pad 1: 2 0,1; 3 1.25,1; 4 2.5,1; 5 3.75,1; 6 5.02,1
XTAL_ECS-120-18-33-JGN-TR3 = smd 1.3 x 1.1: 1 -1.15,-0.9; 2 1.15,-0.9; 3 1.15,0.9; 4 -1.15,0.9
XTAL_ECS-120-20-23B-TR = smd 2 x 1.4: 1 -2.2,-1.2; 2 2.2,-1.2; 3 2.2,1.2; 4 -2.2,1.2

### Placement (x,y rotation side)
BMS_STAT  32.2,15.2 0 top
C1  26.6,35.62 180 top
C2  26.4,26.96 180 top
C3  35.8,26.25 270 top
C4  26.4,25.55 180 top
C5  26.4,29.53 180 top
C6  34.25,26.25 270 top
C7  26.6,34.35 180 top
C8  38.31,31.09 0 top
C9  38.31,32.44 0 top
C10  34.22,36.33 180 top
C11  27.3,50.9 0 top
C12  20.9,51 180 top
C13  45.04,19.04 45 top
C14  21.5,44.4 180 top
C15  43.5,36.4 0 top
C16  48.16,25.86 135 top
C17  36.94,20.9 45 top
C18  47.1,23.34 135 top
C19  38.5,24.12 45 top
C20  23.7,49.2 180 top
C21  28.05,23.6 180 top
C22  31.5,23.6 0 top
C23  38.31,28.43 0 top
C24  30,36.35 180 top
C25  31.7,40.2 0 top
C26  37.1,50.4 0 top
C27  31.5,51.8 90 top
C28  26.1,43.2 270 top
C29  36.23,39.75 270 top
C30  34.92,39.75 270 top
C31  38.3,45.8 0 top
C32  27.5,43.2 270 top
C33  42.02,42.19 315 top
C34  38.3,47.2 0 top
C35  51.5,46.1 270 top
C36  39.9,42.4 270 top
C37  38.5,42.4 270 top
CR1  40.7,51.2 180 top
GANG  54.99,26.75 90 top
J1  4.13,33.55 270 top
J2  4.13,15.05 270 top
J3  60.89,15.05 90 top
J6  41.78,-0.85 0 top
J7  41.78,11.96 180 top
J8  23.68,6.47 0 top
OVR1  22.8,38.6 0 top
OVR2  24.2,38.6 0 top
OVR3  25.6,38.6 0 top
OVR4  27,38.6 0 top
PWR/I2C  28.4,38.6 0 top
R1  38.8,55.1 270 top
R5  53.5,26.75 90 top
R6  52,26.75 270 top
R7  37.87,19.87 225 top
R8  44.56,27.2 45 top
R9  42.88,42.92 135 top
R10  43.69,43.65 135 top
R11  57.7,29.8 0 top
R12  55.9,44.4 0 top
R13  55.9,45.8 180 top
R14  55.9,47.2 0 top
R15  22.7,43.2 180 top
R16  37.3,42.2 270 top
R21  26.4,28.2 0 top
R22  38.31,26.9 180 top
R23  38.31,29.76 0 top
R24  37.5,36.9 0 top
R25  37.5,35.4 180 top
S1  57.6,33.94 90 top
SWCLK  18.1,40.3 0 top
SWDIO  19.2,40.3 0 top
U2  13.24,33.55 90 top
U3  13.18,15.05 90 top
U4  51.7,15.05 270 top
U5  47.7,45.6 0 top
U6  32.4,45.86 270 top
U7  23.8,51 180 top
U8  42.62,22.18 225 top
U9  57.5,40.4 90 top
U10  24.25,32.81 90 top
U11  32.5,31.62 0 top
U$1  23.7,8 180 top
U$2  49.9,50.2 180 top
U$3  43.7,48.2 0 top
VCC_5V  33.6,15.2 0 top
VCC_A  20.5,40.3 0 top
VCC_D  21.6,40.3 0 top
Y1  23.5,46.8 180 top
Y2  29.7,20.5 0 top

### Tracks (layer width: path | path; a pad name or v marks a point on that pad's centre or on a via)
3V3  (via drill 0.2)
  Top 0.203: U6.48 U6.49
  Top 0.305: C25.1 31.4,40.75 U6.33 | C27.1 31.4,50.85 U6.10 | C26.1 36.25,49.75 35.79,49.29 U6.1 | C11.1 26.23,50.68 v24.9,50.68 U7.1 | C28.1 26.1,45 26.76,45.66 U6.22 | U6.44 35.31,43.66 35,43.35 U6.42 35,40.48 C30.1 C29.1 v36.23,41.8 37.2,41.8 R16.2 | R11.2 v59.5,29.8 | C31.1 37.62,45.8 | U6.49 37.31,45.66 C31.1 | C31.1 37.6,45.8 v38.24,46.44 | U5.8 51.35,46.8 C35.1
  Top 0.406: v52.5,46.75 51.7,46.75 C35.1 | v35.38,51.27 35.38,53.12 36.5,54.25 R1.2
  Top 0.813: C26.1 v35.38,51.27 | C25.1 29.9,40.2 v29.88,40.23 | C28.1 v25.1,44.05 | C27.1 v30.5,50.95 v29.9,50.35 | R13.1 v57.7,45.8
  Route2 0.813: v25.1,44.05 26.9,45.85 | 52.5,46.8 v52.5,46.75 52.5,43.4 56.1,39.8 56.1,31 57.3,29.8 v59.5,29.8 | 42.5,49.15 U$3.1 | 52.5,46.8 51.5,47.8 43.3,47.8 42.5,48.6 42.5,49.15 | v57.7,45.8 53.5,45.8 52.5,46.8 | 38.3,48.35 v35.38,51.27 30.82,51.27 v30.5,50.95 29.43,49.88 v27.5,49.88 v26.9,49.28 26.9,45.85 | v29.88,40.23 31,40.23 | 31,40.23 34.65,40.23 v36.23,41.8 | 38.3,48.35 41.7,48.35 42.5,49.15 | v38.24,46.44 38.24,48.29 38.3,48.35 | 26.9,45.85 26.9,44.33 31,40.23
  other vias: 26.3,49.88 26.9,49.88 27.5,49.28 26.3,49.28
  pour Top (no thermals): 25.9,51.2 25.9,49 26.1,48.8 27.7,48.8 27.9,49 27.9,49.8 27.9,50 27.7,50.2 27.3,50.2 27.1,50.4 27.1,51.2 26.9,51.4 26.1,51.4
BMS_STAT
  Top 0.203: J6.B8 J7.13 40.03,11.37 37.6,13.8 33.6,13.8 BMS_STAT.TP
CC1
  Top 0.203: J7.12 J6.A5
CC2
  Top 0.203: J7.6 J6.B5
DD0_N  (via drill 0.2, 0.2 pad 0.45)
  Top 0.192: v40.95,11 41.1,10.85 41.1,10.81 41.12,10.79 41.12,10.32 41.03,10.22 J7.11 41.03,8.47 41.23,8.28 41.83,8.28 42.03,8.48 J7.9 | U11.1 29.26,33.12 29.14,33 25.28,33 U10.2 24.09,33.3 24,33.22 22.93,33.22 22.83,33.12 22.69,33.26 22.31,33.26 22.05,33 22.05,32.96 21.5,32.96 21.4,33.06 v21.4,33.11
  Bottom 0.192: v40.95,11 41.1,11.15 41.1,12 39.82,13.28 20.18,13.28 15.79,17.67 15.79,28.13 20.08,32.42 20.13,32.47 20.63,32.96 21.25,32.96 v21.4,33.11
DD0_N1
  Top 0.192: J6.B7 41.03,7.35 41.27,7.6 41.77,7.6 42.03,7.35 J6.A7
DD0_P  (via drill 0.2, 0.2 pad 0.45)
  Top 0.192: J7.10 41.53,10.22 | 41.53,10.22 41.43,10.32 41.43,10.88 v41.55,11 | J7.8 42.5,9.37 42.5,10 42.28,10.22 41.53,10.22 | U11.2 29.26,32.62 29.19,32.69 25.35,32.69 U10.1 24.09,32.31 24,32.41 22.93,32.41 22.83,32.5 22.69,32.36 22.31,32.36 22.05,32.62 22.05,32.66 21.5,32.66 21.4,32.56 v21.4,32.51
  Bottom 0.192: v41.55,11 41.41,11.15 41.41,12.13 39.94,13.59 20.31,13.59 16.1,17.8 16.1,28 20.76,32.66 21.25,32.66 v21.4,32.51
DD0_P1
  Top 0.192: J6.A6 41.53,5.45 41.77,5.2 42.3,5.2 42.53,5.43 J6.B6
DD1_N
  Top 0.192: J1.2 10.38,33.9 10.91,33.9 11.09,34.08 11.53,34.08 11.64,33.96 12.69,33.96 12.7,33.95 12.99,33.95 13.08,34.05 U2.2 14.3,33.71 17.19,33.71 19.7,31.2 27.57,31.2 28.39,32.02 29.27,32.02 29.36,32.12 U11.3
DD1_P
  Top 0.192: J1.3 10.38,33.2 10.91,33.2 11.09,33.02 11.53,33.02 11.64,33.14 12.69,33.14 12.7,33.15 12.99,33.15 13.08,33.05 U2.1 14.31,33.4 17.07,33.4 19.57,30.89 27.69,30.89 28.52,31.72 29.37,31.72 29.46,31.62 U11.4
DD2_N  (via drill 0.2, 0.2 pad 0.45)
  Top 0.192: v17.5,18.65 17.73,18.42 17.73,17.33 15.68,15.28 14.17,15.28 U3.2 13.01,15.54 12.92,15.46 12.63,15.46 12.62,15.46 11.58,15.46 11.47,15.58 11.03,15.58 10.86,15.4 10.38,15.4 J2.2 | U11.6 29.26,30.62 29.17,30.52 28.9,30.52 28.75,30.67 v28.3,30.67
  Bottom 0.192: v17.5,18.65 17.72,18.87 17.72,26.45 21.79,30.52 28.15,30.52 v28.3,30.67
DD2_P  (via drill 0.2, 0.2 pad 0.45)
  Top 0.192: v18.26,18.65 18.03,18.42 18.03,17.2 15.8,14.97 14.31,14.97 U3.1 13.01,14.55 12.92,14.64 12.63,14.64 12.62,14.64 11.58,14.64 11.47,14.52 11.03,14.52 10.86,14.7 10.38,14.7 J2.3 | U11.7 29.26,30.12 29.17,30.22 28.9,30.22 28.75,30.07 v28.3,30.07
  Bottom 0.192: v18.26,18.65 18.02,18.89 18.02,26.32 21.92,30.22 28.15,30.22 v28.3,30.07
DD3_N  (via drill 0.2, 0.2 pad 0.45)
  Top 0.192: J3.2 54.65,14.7 53.79,14.7 53.69,14.6 53.31,14.6 53.27,14.64 52.25,14.64 52.24,14.64 51.95,14.64 51.86,14.55 U4.2 50.09,14.55 49.89,14.76 v49,14.76 | U11.12 33,28.38 33.1,28.28 33.1,27.1 32.29,26.29 32.29,25.07 32.97,24.39 33.3,24.39 33.9,23.79 33.9,21.4 33.8,21.3 v33.75,21.3
  Bottom 0.192: v49,14.76 48.86,14.89 37.07,14.89 33.9,18.07 33.9,21.15 v33.75,21.3
DD3_P  (via drill 0.2, 0.2 pad 0.45)
  Top 0.192: J3.3 54.65,15.4 53.79,15.4 53.69,15.5 53.31,15.5 53.27,15.46 52.25,15.46 52.24,15.46 51.95,15.46 51.86,15.54 U4.1 50.09,15.54 49.89,15.34 v49,15.34 | U11.13 33.5,28.38 33.41,28.28 33.41,26.98 32.6,26.17 32.6,25.2 33.1,24.7 33.43,24.7 34.21,23.92 34.21,21.4 34.31,21.3 v34.35,21.3
  Bottom 0.192: v49,15.34 48.86,15.2 37.2,15.2 34.21,18.19 34.21,21.15 v34.35,21.3
DD4_N  (via drill 0.2)
  Top 0.192: v46.9,41 46.9,41.2 46.5,41.6 44.79,41.6 43.82,42.57 R9.1 | U11.15 35.74,30.12 35.9,29.96 35.9,29.4 35.8,29.3 v35.75,29.3
  Bottom 0.192: v46.9,41 47.08,41 48.5,39.58 48.5,32.6 47.11,31.21 40.21,31.21 39.51,30.51 36.28,30.51 35.9,30.13 35.9,29.45 v35.75,29.3
DD4_P  (via drill 0.2)
  Top 0.192: v47.31,41.41 47.12,41.41 46.62,41.91 44.92,41.91 44.05,42.78 R10.1 | U11.16 35.74,30.62 36.21,30.16 36.21,29.4 36.31,29.3 v36.35,29.3
  Bottom 0.192: v47.31,41.41 47.31,41.22 48.81,39.72 48.81,32.47 47.23,30.9 40.33,30.9 39.63,30.2 36.41,30.2 36.21,30 36.21,29.45 v36.35,29.3
GANG  (via drill 0.2, 0.2 pad 0.45)
  Top 0.203: GANG.A 53.6,27.5 R5.2 53.5,29.3 51,31.8 45.51,31.8 v44.4,32.91 | U11.23 v33.5,35.4
  Bottom 0.203: v44.4,32.91 40.81,36.5 34.6,36.5 v33.5,35.4
GND  (via drill 0.2, 0.2 pad 0.45)
  Top 0.192: U10.3 v22.5,32.81
  Top 0.203: 53.5,26 R5.1 | R8.2 45.16,27.86 v45.7,28.4 | U6.19 v29.7,46.86
  Top 0.305: C1.2 v24.9,35.62 | J8.1 v27.28,5.4 | J8.4 v26.08,5.4 | J8.7 v24.88,5.4 | J8.10 v23.68,5.4 | J8.13 v22.48,5.4 | v51.2,26.8 R6.1 53.5,26.1 53.5,26 | J7.18 J7.17 J7.16 J7.15 J7.14 | J7.MP2 v33.7,12.04 | J7.MP1 v49.9,12.04 | U$1.3 v28.45,9.4 | U$1.2 v28.95,9 | U$1.1 v29.45,9.4 | U$1.24 v17.95,9 | U$1.23 v18.45,9.4 | U$1.P$26 v16.71,11.6 | U$1.P$28 v22.52,12.4 | U$1.P$27 v24.88,12.4 | U$1.P$25 v30.69,11.6 | C26.2 v38.95,50.4 | C27.2 v31.5,53.6 | v28.15,51.8 C11.2 | C12.2 v20.05,51.8 | v32.55,41 C25.2 | Y1.4 v24.65,45 | C28.2 v26.1,41.35 | C14.2 v20.65,43.6 | Y1.2 v21.3,47.7 | C20.2 v22.85,50 | U5.4 44.92,44.4 v44.9,44.42 | v39.92,45.83 39.12,45.83 | 39.12,45.83 39.12,47.17 C34.2 39.7,47.2 39.9,47 v39.9,46.8 | C31.2 39.12,45.83 | S1.4 S1.3 v59.5,31.68 | S1.4 58.7,38.04 | 58.7,38.04 U9.3 v59.5,38.14 | 58.7,38.04 58.7,42.56 U9.4 v59.5,42.66 | S1.4 v59.5,36.2 | C29.2 C30.2 v34.92,38.4 | C32.2 v27.5,41.4 | U7.5 24.12,51.32 U7.2 v24.9,51.32 | C37.2 v38.5,41 | v40.75,41.75 C36.2 | U$1.22 v18.95,9 | U$1.6 v26.95,8.8 | U$1.9 v25.45,8.8 | U$1.12 v23.95,8.8 | U$1.15 v22.45,8.8 | v33.37,37.2 C10.2 | C5.2 v24.6,29.53 | R21.1 25.39,28.04 v24.6,28.04 | C2.2 v24.6,26.96 | C4.2 v24.6,25.55 | v33.2,25.4 C6.2 C3.2 | Y2.2 v33.3,19.3 | Y2.4 v26,21.7 | C21.2 v27.2,24.5 | C22.2 v33.2,23.6 | R25.1 39.1,35.4 v39.3,35.2 | v40.1,32.44 C9.2 C8.2 | U6.57 v32.4,45.85 | v40.1,28.43 C23.2 R22.1 v40.1,26.9 | C24.2 29.09,36.35 v28.25,37.19 | C35.2 v51.5,44.3
  Top 0.406: C5.2 C4.2 | U2.3 v11.31,33.55 | U3.3 v11.25,15.05 | U4.3 v53.5,15.05 | C17.1 v35.73,21.03 | v35.73,21.03
  Top 0.508: J6.A1B12 37.98,6.61 J6.SHIELD_1 v36.5,5.93 | J6.B1A12 45.28,6.61 J6.SHIELD_3 v47.25,5.93 | J1.S3 v1.64,38.75 | J1.S1 v7.74,38.75 | v1.64,28.75 J1.S4 | v7.74,28.5 J1.S2 | J1.4 v11.25,30.05 | J2.S3 v1.64,20 | J2.S1 7.78,22.64 v9.44,22.64 | v7.74,10 J2.S2 | J6.SHIELD_2 v36.5,1.75 | J6.SHIELD_4 v47.25,1.75 | J3.S2 v57.29,20 | J3.S4 v63.39,20 | v57.29,9.75 J3.S1 | J2.4 v11.25,11.55 | J3.4 55.5,18.34 v55.5,17.3 | U$3.2 v43.7,50
  Top 0.813: C15.2 v46,35.2
  other vias: 46,38.5 37,10.9 37.75,10.9 38.5,10.9 39.25,10.9 39.25,10.15 38.5,10.15 37.75,10.15 37,10.15 18.75,19.2 17,19.2 50.85,7.95 51.85,7.95 51.85,6.95 50.85,6.95 49.55,16.05 49.55,14.25 13.85,7.55 14.85,7.55 14.85,6.55 13.85,6.55 45,38.5 47.2,38.5 13.85,5.55 14.85,5.55 50.85,5.95 51.85,5.95 16.8,19.8 18.95,19.8 17.2,17.8 18.2,16.6 17.2,15.4 16,16.6 13.35,42.95 14.35,42.95 14.35,41.95 13.35,41.95 13.35,40.95 14.35,40.95 32.85,7.75 33.85,7.75 33.85,6.75 32.85,6.75 32.85,5.75 33.85,5.75 19.35,32.55 18.15,31.43 63.05,16.35 64.05,16.35 64.05,15.35 63.05,15.35 63.05,14.35 64.05,14.35 1.25,15.95 2.25,15.95 2.25,14.95 1.25,14.95 1.25,13.95 2.25,13.95 0.85,34.95 1.85,34.95 1.85,33.95 0.85,33.95 0.85,32.95 1.85,32.95 20.55,17.15 20.55,18.15 21.55,18.15 21.55,17.15 22.55,17.15 22.55,18.15 41.65,22.23 42.6,23.12 42.65,21.18 43.55,22.07 42.6,22.18 47.05,19.05 47.55,20.15 47.55,19.55 47.15,20.65 49.96,23.1 49.35,23.6 49.96,24.21 50.57,23.7 51.17,24.31 50.57,24.82 31.7,46.6 31.7,45.2 33.1,45.2 33.1,46.6 47.7,45.6 47.7,44.8 47.7,46.4 47.9,41.82 46.3,40.42 62.35,41.25 63.35,41.25 63.35,40.25 62.35,40.25 62.35,39.25 63.35,39.25 62.35,35.05 63.35,35.05 63.35,34.05 62.35,34.05 62.35,33.05 63.35,33.05 62.35,29.05 63.35,29.05 63.35,28.05 62.35,28.05 62.35,27.05 63.35,27.05 59.75,58.65 60.75,58.65 60.75,57.65 59.75,57.65 59.75,56.65 60.75,56.65 13.35,49.65 14.35,49.65 14.35,48.65 13.35,48.65 13.35,47.65 14.35,47.65 4.55,58.65 5.55,58.65 5.55,57.65 4.55,57.65 4.55,56.65 5.55,56.65 31.5,32.5 33.5,32.5 32.5,31.6 31.5,30.6 33.5,30.5 29.1,29.55 28.8,31.25 33.4,21.9 34.7,21.9 35.15,29.55 36.45,28.6 22.55,23.65 22.55,22.65 21.55,22.65 21.55,23.65 20.55,23.65 20.55,22.65 13.45,19.55 12.45,19.55 12.45,20.55 13.45,20.55 13.45,21.55 12.45,21.55 13.45,26.75 12.45,26.75 12.45,27.75 13.45,27.75 13.45,28.75 12.45,28.75 20.95,32.02 20.95,33.62 19.35,30.35 52.55,32.95 51.55,32.95 51.55,33.95 52.55,33.95 52.55,34.95 51.55,34.95 52.65,38.45 51.65,38.45 51.65,39.45 52.65,39.45 52.65,40.45 51.65,40.45
  pour Top (isolate 0.406, rank 3): -4.33,63.67 -4.33,-3.6 70.04,-3.6 70.04,63.67
  pour Bottom (isolate 0.61, rank 3): -5.6,64.94 -5.6,-4.87 71.31,-4.87 71.31,64.94
  pour Route2: -6.9,66.2 -6.9,-6.4 72.7,-6.4 72.7,66.2
  pour Route15: -8.3,67.4 -8.3,-8 74.1,-8 74.1,67.4
  pour Top (no thermals): 51.75,24.25 49.6,26.4 47.57,24.37 49.72,22.22
  pour Top (no thermals): 40.7,23.6 41.5,22.8 40.9,22.2 42.6,20.5 44.3,22.2 42.6,23.9 41.7,23 40.9,23.8
  pour Top (no thermals): 43.05,20.55 44.91,18.69 arc45 45.13,18.6 47.17,18.6 arc45 47.39,18.69 48.01,19.31 arc45 48.1,19.53 48.1,20.57 arc45 48.01,20.79 47.89,20.91 arc45 47.67,21 45,21 44.25,21.75
  pour Top (no thermals): 36.72,8.9 39.38,8.9 arc90 39.7,9.22 39.7,10.98 arc90 39.38,11.3 36.72,11.3 arc90 36.4,10.98 36.4,9.22 arc90
  pour Top (no thermals): 30.6,33.5 30.6,29.8 34.4,29.8 34.4,31.4 35.5,31.4 35.5,31.85 34.4,31.85 34.4,33.5
GND\  (via drill 0.2 pad 0.45)
  Top 0.406: C19.1 37.9,23.5 v37.21,22.81
GPIO1/CS  (via drill 0.2)
  Top 0.102: U6.3 v34.2,50.2
  Bottom 0.102: v34.2,50.2 33.3,49.3 33.3,48.27 33.77,47.8 46.05,47.8 U$3.5
GPIO2/CLK  (via drill 0.2)
  Top 0.102: U6.4 v33.8,48.4
  Bottom 0.102: v33.8,48.4 34,48.2 45.2,48.2 U$3.4
GPIO3/MOSI  (via drill 0.2)
  Top 0.102: v33.6,50.2 33.4,50 U6.5
  Bottom 0.102: v33.6,50.2 35.6,52.2 42.5,52.2 44.95,49.75 U$3.3
GPIO4/RST  (via drill 0.2)
  Top 0.102: U6.6 v33,50.4
  Bottom 0.102: v33,50.4 35.4,52.8 42.9,52.8 45.3,50.4 49.95,50.4 U$2.1
GPIO5/DC  (via drill 0.2)
  Top 0.102: v32.4,50.2 32.6,50 U6.7
  Bottom 0.102: v32.4,50.2 32.6,50 32.6,48.3 33.5,47.4 46.9,47.4 48.7,49.2 U$3.6
GPIO6/BTN  (via drill 0.2)
  Top 0.102: U6.8 v32.2,48.21 v32.2,48.2 | v50.5,50.59 50.5,50 49.9,49.4 U$2.2
  Bottom 0.102: v32.2,48.2 31.7,48.7 31.7,50.2 34.83,53.33 43.38,53.33 45.7,51 50.09,51 v50.5,50.59
HDMI1_CEC
  Top 0.126: U$1.16 21.95,7.45 22.08,7.32 J8.14
HDMI1_CLK_N
  Top 0.126: U$1.14 23.05,7.9 23.05,7.35 22.88,7.18 J8.12
HDMI1_CLK_P
  Top 0.126: U$1.13 23.35,7.9 23.35,7.25 23.28,7.18 J8.11
HDMI1_HOTPLUG
  Top 0.305: J8.19 19.73,6.47 19.45,6.75 U$1.21
HDMI1_SCL
  Top 0.126: J8.15 21.68,7.22 21.45,7.45 U$1.17
HDMI1_SDA
  Top 0.126: U$1.18 20.95,7.45 21.28,7.12 J8.16
HDMI1_TX0_N
  Top 0.126: U$1.11 24.55,7.9 24.55,7.55 24.08,7.08 J8.9
HDMI1_TX0_P
  Top 0.126: U$1.10 24.85,7.9 24.85,7.45 24.48,7.08 J8.8
HDMI1_TX1_N
  Top 0.126: U$1.8 25.95,7.65 25.28,6.98 J8.6
HDMI1_TX1_P
  Top 0.126: J8.5 25.68,6.98 26.1,7.4 26.24,7.4 26.45,7.61 U$1.7
HDMI1_TX2_N
  Top 0.126: U$1.5 27.45,7.57 27.28,7.4 26.9,7.4 26.48,6.98 J8.3
HDMI1_TX2_P
  Top 0.126: J8.2 26.88,7 27.05,7.17 27.09,7.17 | 27.09,7.17 | U$1.4 27.95,7.72 27.39,7.17 27.09,7.17
HDMI_5.0V
  Top 0.305: U$1.20 19.95,7.55 20.48,7.02 J8.18
N$1
  Top 0.203: R6.2 52,25 52.5,24.5 54.5,24.5 55,25 GANG.C
N$3
  Top 0.305: Y2.1 27.9,19.3 29,20.4 29,23.5 C21.1 29.4,24.1 29.4,25.6 30.1,26.3 30.5,26.3 32,27.8 U11.10
N$4
  Top 0.305: Y2.3 32,21.8 31.3,21.8 30.65,22.45 C22.1 30.02,24.23 30.02,25.38 30.38,25.73 30.8,25.73 32.5,27.43 U11.11
N$5  (via drill 0.2)
  Top 0.305: C32.1 27.5,44.8 27.96,45.26 U6.23 29.7,45.26 v29.9,45.46 | U6.50 36.31,46.06 36.83,46.58 | 36.83,46.58 C34.1 | v33.7,43.6 34.16,44.06 U6.45 40.15,44.06 C33.1 | 36.83,46.58 36.78,46.58 36.76,46.55 v36.65,46.55
  Route2 0.305: v29.9,45.46 29.9,45.86 31.44,47.4 35.8,47.4 v36.65,46.55
  Bottom 0.305: v33.7,43.6 33.1,43.6 32.3,44.4 31.56,44.4 30.5,45.46 v29.9,45.46
N$5_N
  Top 0.192: U6.46 36.64,44.46 36.7,44.52 41.69,44.52 42.05,44.15 42.15,44.05 42.53,43.67 R9.2
N$5_P
  Top 0.192: U6.47 36.64,44.86 36.7,44.8 41.8,44.8 42.72,43.88 43.22,43.88 R10.2
N$8
  Top 0.203: U8.14 38.64,19.27 R7.2
N$11
  Top 0.406: C18.2 45.44,23.95 U8.2
N$12
  pour Top (no thermals): 45,23 44.5,22.5 44.5,21.9 45.01,21.39 arc45 45.23,21.3 47.1,21.3 48.5,22.7 47.65,23.55 46.7,22.6 45.9,22.6 45.5,23
N$13
  Top 0.406: C19.2 39.1,24.64 U8.11
N$14
  Top 0.203: U8.9 40.83,24.33 | 40.83,24.33 | R8.1 43.46,26.1 42.1,26.1 40.83,24.83 40.83,24.33
N$15
  Top 0.305: R14.1 R13.2 R12.1 55.1,44.35 55.1,43.2 55.64,42.66 U9.2 U9.1
N$16
  Top 0.102: R15.2 22.35,43.35 C14.1 Y1.3
N$17
  Top 0.305: U6.43 36.4,42.7 R16.1 38.35,42.7 38.48,42.83 | C37.1 38.27,42.83 38.48,42.83 | C36.1 39.67,42.83 38.48,42.83
N$18  (via drill 0.2)
  Top 0.102: CR1.1 51.1,51.2 53.5,48.8 v53.5,43.8
  Top 0.203: R12.2 v57.7,44.4
  Bottom 0.102: v53.5,43.8 54.1,44.4 v57.7,44.4
N$19
  Top 0.102: U11.25 32.5,35.1 32.3,35.3 32.3,36.3 31,37.6 23.8,37.6 OVR1.TP
N$20
  Top 0.102: OVR2.TP 24.9,37.9 31.1,37.9 32.54,36.46 32.54,35.46 33,35 U11.24
N$21  (via drill 0.2)
  Top 0.102: U11.20 34.98,32.6 v35.68,32.6 | OVR3.TP v25.6,39.4
  Bottom 0.102: v35.68,32.6 35.68,32.9 35.18,33.4 29.3,33.4 26.2,36.5 26.2,38.8 v25.6,39.4
N$22  (via drill 0.2)
  Top 0.102: U11.19 v36.1,32.12 | OVR4.TP v27,39.4
  Bottom 0.102: v36.1,32.12 36.09,32.13 36.09,32.77 35.27,33.59 29.38,33.59 26.4,36.57 26.4,38.8 v27,39.4
N$34
  Top 0.203: U11.8 30.04,28.2 R21.2
N$35
  Top 0.203: C23.1 37.46,29.5 R23.1
  Top 0.305: R22.2 37.46,29.5 | C23.1 R23.1 37.34,29.76 35.99,31.12 U11.17
N$36
  Top 0.305: U11.22 35.32,34.07 R25.2 R24.1
PWR/I2C_SDA  (via drill 0.2)
  Top 0.102: v31.89,36 32,35.89 U11.26 | PWR/I2C.TP v29.2,38.6
  Bottom 0.102: v31.89,36 29.29,38.6 v29.2,38.6
QSPI_CS
  Top 0.102: U5.1 45.33,46.4 43.1,46.4 40.64,48.86 38.7,48.86 | 38.7,48.86 36.24,48.86 U6.56 | 38.7,48.86 39.5,49.66 39.5,51.15 CR1.2 39.55,51.28 40.3,52.03 40.3,55.2 39.55,55.95 R1.1
QSPI_SCLK  (via drill 0.2)
  Top 0.102: U6.52 35.16,46.86 v34.5,46.2 | U5.6 v50.5,45.2
  Bottom 0.102: v34.5,46.2 34.3,46 34.3,44.6 35.3,43.6 49.1,43.6 50.5,45 v50.5,45.2
QSPI_SD0  (via drill 0.2)
  Top 0.102: U6.53 34.77,47.26 v34.31,46.8 | U5.5 v50.5,44.4
  Bottom 0.102: v34.31,46.8 33.9,46.39 33.9,44.4 35.1,43.2 49.3,43.2 v50.5,44.4
QSPI_SD1
  Top 0.102: U5.2 42.9,46 40.44,48.47 36.71,48.47 36.3,48.06 U6.55
QSPI_SD2
  Top 0.102: U5.3 45.7,45.2 45.3,45.6 42.7,45.6 40.3,48 36.84,48 36.5,47.66 U6.54
QSPI_SD3  (via drill 0.2)
  Top 0.102: v34.9,45.6 34.9,45.87 35.48,46.46 U6.51 | U5.7 v50.5,46
  Bottom 0.102: v34.9,45.6 34.7,45.4 34.7,44.8 35.5,44 48.9,44 49.7,44.8 49.7,45.2 v50.5,46
RUN  (via drill 0.2)
  Top 0.102: U6.26 v29.7,44.06 | v55.1,37 55.9,36.2 S1.2
  Top 0.305: R11.1 56.5,30.15 S1.1 S1.2
  Bottom 0.102: v55.1,37 55.1,40.8 53.52,42.38 31.38,42.38 v29.7,44.06
SWCLK  (via drill 0.2)
  Top 0.102: U6.24 30.38,44.86 v30.4,44.84 | SWCLK.TP v18.1,41.1
  Bottom 0.102: v18.1,41.1 18.6,41.6 24.1,41.6 27.34,44.84 v30.4,44.84
SWDIO  (via drill 0.2)
  Top 0.102: U6.25 29.52,44.46 29.53,44.46 30.04,44.46 v30.5,44 | SWDIO.TP v19.2,41.1
  Bottom 0.102: v19.2,41.1 24.4,41.1 27.9,44.6 29.9,44.6 v30.5,44
USER_SW  (via drill 0.2)
  Top 0.102: U6.35 v32.2,43.4
  Top 0.203: R14.2 v56.75,48.2
  Bottom 0.102: v32.2,43.4 32.83,42.77 51.88,42.77 56.75,47.65 v56.75,48.2
VBUS  (via drill 0.2 pad 0.45)
  other vias: 39.38,8.18 44.3,8.18 44.9,8.18 45.5,8.18 39.38,7.6 38.78,8.18 38.18,8.2 37.58,8.22 44.3,7.6 44.9,7.6 38.78,7.6 38.18,7.6 37.58,7.62 45.5,7.6 46.1,8.18 46.1,7.6
  pour Top (no thermals): 37.52,8.6 39.28,8.6 arc-90 39.6,8.28 39.6,6.2 39.12,6.2 39.12,7.25 37.52,7.25 arc-90 37.2,7.57 37.2,8.28 arc-90
  pour Bottom: 46.5,7.52 46.5,8.28 arc90 46.18,8.6 37.42,8.6 arc90 37.1,8.28 37.1,7.52 arc90 37.42,7.2 46.18,7.2 arc90
  pour Top (no thermals): 43.9,7.4 43.9,6.32 arc90 44.22,6 arc90 44.5,6.28 44.5,7.4
  pour Top (no thermals): 42.5,20.3 41.52,21.28 arc90 41.08,21.28 40.22,20.42 arc90 40.22,19.98 43.81,16.39 arc-45 43.9,16.17 43.9,7.3 46.18,7.3 arc90 46.41,7.52 46.41,16.89 43,20.3
VCC
  Top 0.305: C17.2 R7.1 | R7.1 39.14,20.47 U8.13
  Top 0.406: R7.1
VCC_5V  (via drill 0.2, 0.2 pad 0.45)
  Top 0.203: VCC_5V.TP 34.1,14.7 38,14.7 40.3,12.4 42,12.4 43.05,11.35 v43.05,11
  Top 0.305: v43.05,5.6 43.03,5.57 J6.A8 J7.7 43.03,10.97 v43.05,11 | U7.4 22.07,50.68 C12.1 22.07,51.32 U7.3 | U11.27 v31.5,34.8
  Top 0.508: R23.2 v42.65,29.76
  Top 0.61: v20.3,49.6 v20.7,50 20.77,50.07 20.78,50.07 21.03,50.32 21.03,50.33 v21.1,50.4 21.7,51 C12.1
  Top 0.813: J1.1 v11.1,37.05 | v9.7,19.75 9.7,18.59 J2.1 | J3.1 55.24,11.6 v53.9,11.6
  Route2 0.305: v43.05,5.6 v43.05,11 43.05,19.55 44.8,21.3 v44.8,24.8
  Route2 0.813: v42.65,29.76 40.81,29.76 36.38,34.19 32.12,34.19 31.52,34.78 | v47.5,28.3 56.4,28.3 59.6,25.1 59.6,12.1 58.3,10.8 54.7,10.8 v53.9,11.6 | 16.1,37.05 v11.1,37.05 9.45,37.05 8.9,37.6 6,37.6 4.7,36.3 4.7,21.05 6,19.75 v9.7,19.75 | 16.1,37.05 16.65,37.05 18.91,34.78 31.52,34.78 | v20.3,49.6 16.5,45.8 16.5,37.45 16.1,37.05 | v31.5,34.8 31.52,34.78
  other vias: 43.35,29.76 44.05,29.76 46.5,29.3 46.9,29.8 47,28.8 47.4,29.3 47.9,28.8
  pour Top (no thermals): 48.2,26.6 46.3,24.7 45.7,24.7 44.22,23.22 arc-90 43.78,23.22 42.7,24.3 42.27,23.87 arc-90 41.83,23.87 41.57,24.13 arc-90 41.57,24.57 42.6,25.6 44.8,25.6 47,27.8
  pour Top (no thermals): 46.8,27.6 46.8,28.3 45.9,29.2 38.6,29.2 38.6,30.3 46.77,30.3 arc-45 46.99,30.21 48.21,28.99 arc-45 48.3,28.77 48.3,26.7 46.8,25.2 45.6,26.4
VCC_A  (via drill 0.2)
  Top 0.305: C4.1 C2.1 30.26,26.96 31.5,28.2 U11.9 v31.5,28.5 | VCC_A.TP v20.5,39.4 | C1.1 C7.1 27.43,34.33 27.43,34.27 v28.2,33.5 | U11.14 34,27.35 C6.1 C3.1 v35.8,28 v35.8,28.6 | U11.5 v29.39,31.12 | C5.1 28.17,29.53 v28.6,29.1
  Bottom 0.305: 28.8,32.9 27.45,32.9 25.35,35 23.2,35 20.5,37.7 v20.5,39.4 | 28.8,32.9 29.39,32.31 v29.39,31.12 31.5,29.01 | v31.5,28.5 31.5,29.01 | 31.5,29.01 33.49,29.01 33.9,28.6 v35.8,28.6 | v28.6,29.1 28.69,29.01 31.5,29.01 | v28.2,33.5 28.8,32.9
VCC_D  (via drill 0.2)
  Top 0.203: VCC_D.TP v21.6,39.4
  Top 0.305: U11.28 31,36.2 C24.1 30.75,36.35 v30,35.6 | C10.1 v35.07,35.5 | v36.31,33.13 v36.3,33.12 U11.21 36.78,33.12 C9.1 C8.1
  Top 0.61: C9.1 37.46,33.16
  Top 0.813: R24.2 40.5,36.9 C15.1 41,34.6 40.2,33.8 38.1,33.8 37.46,33.16
  Route2 0.305: v30,35.6 26.2,35.6 25.1,36.7 23.2,36.7 21.6,38.3 v21.6,39.4
  Bottom 0.305: v36.31,33.13 36.31,34.26 v35.07,35.5 34.37,34.8 32.3,34.8 31.5,35.6 v30,35.6
XTAL_IN
  Top 0.203: Y1.1 26,47.7 27.24,46.46 U6.20
  Top 0.305: C20.1 24.65,49.1 Y1.1
XTAL_OUT
  Top 0.203: U6.21 27.04,46.06 26.3,46.8 23.9,46.8 23.5,46.4 23.5,43.5 R15.1

### Text on the board
tPlace: MOSI | CLk | CS | DC | BTN | RST | 3V3 | GND | Raspberry Pi Pico | R25: / DNP for self-powered applications | + | BOOT | RST | 4-Port USB Hub | 5V2A Buck Converter
tNames: SSD1351 OLED Pins | 4 Port USB Hub / CM4 Docking Station / StonedEdge | RP2040 | CY7C65642 | C18 | MAXM17634 | J9 | J6